# EAGLE design pokey (EAGLE 6.6.0)

## Sheet 1 of 6: Paddles
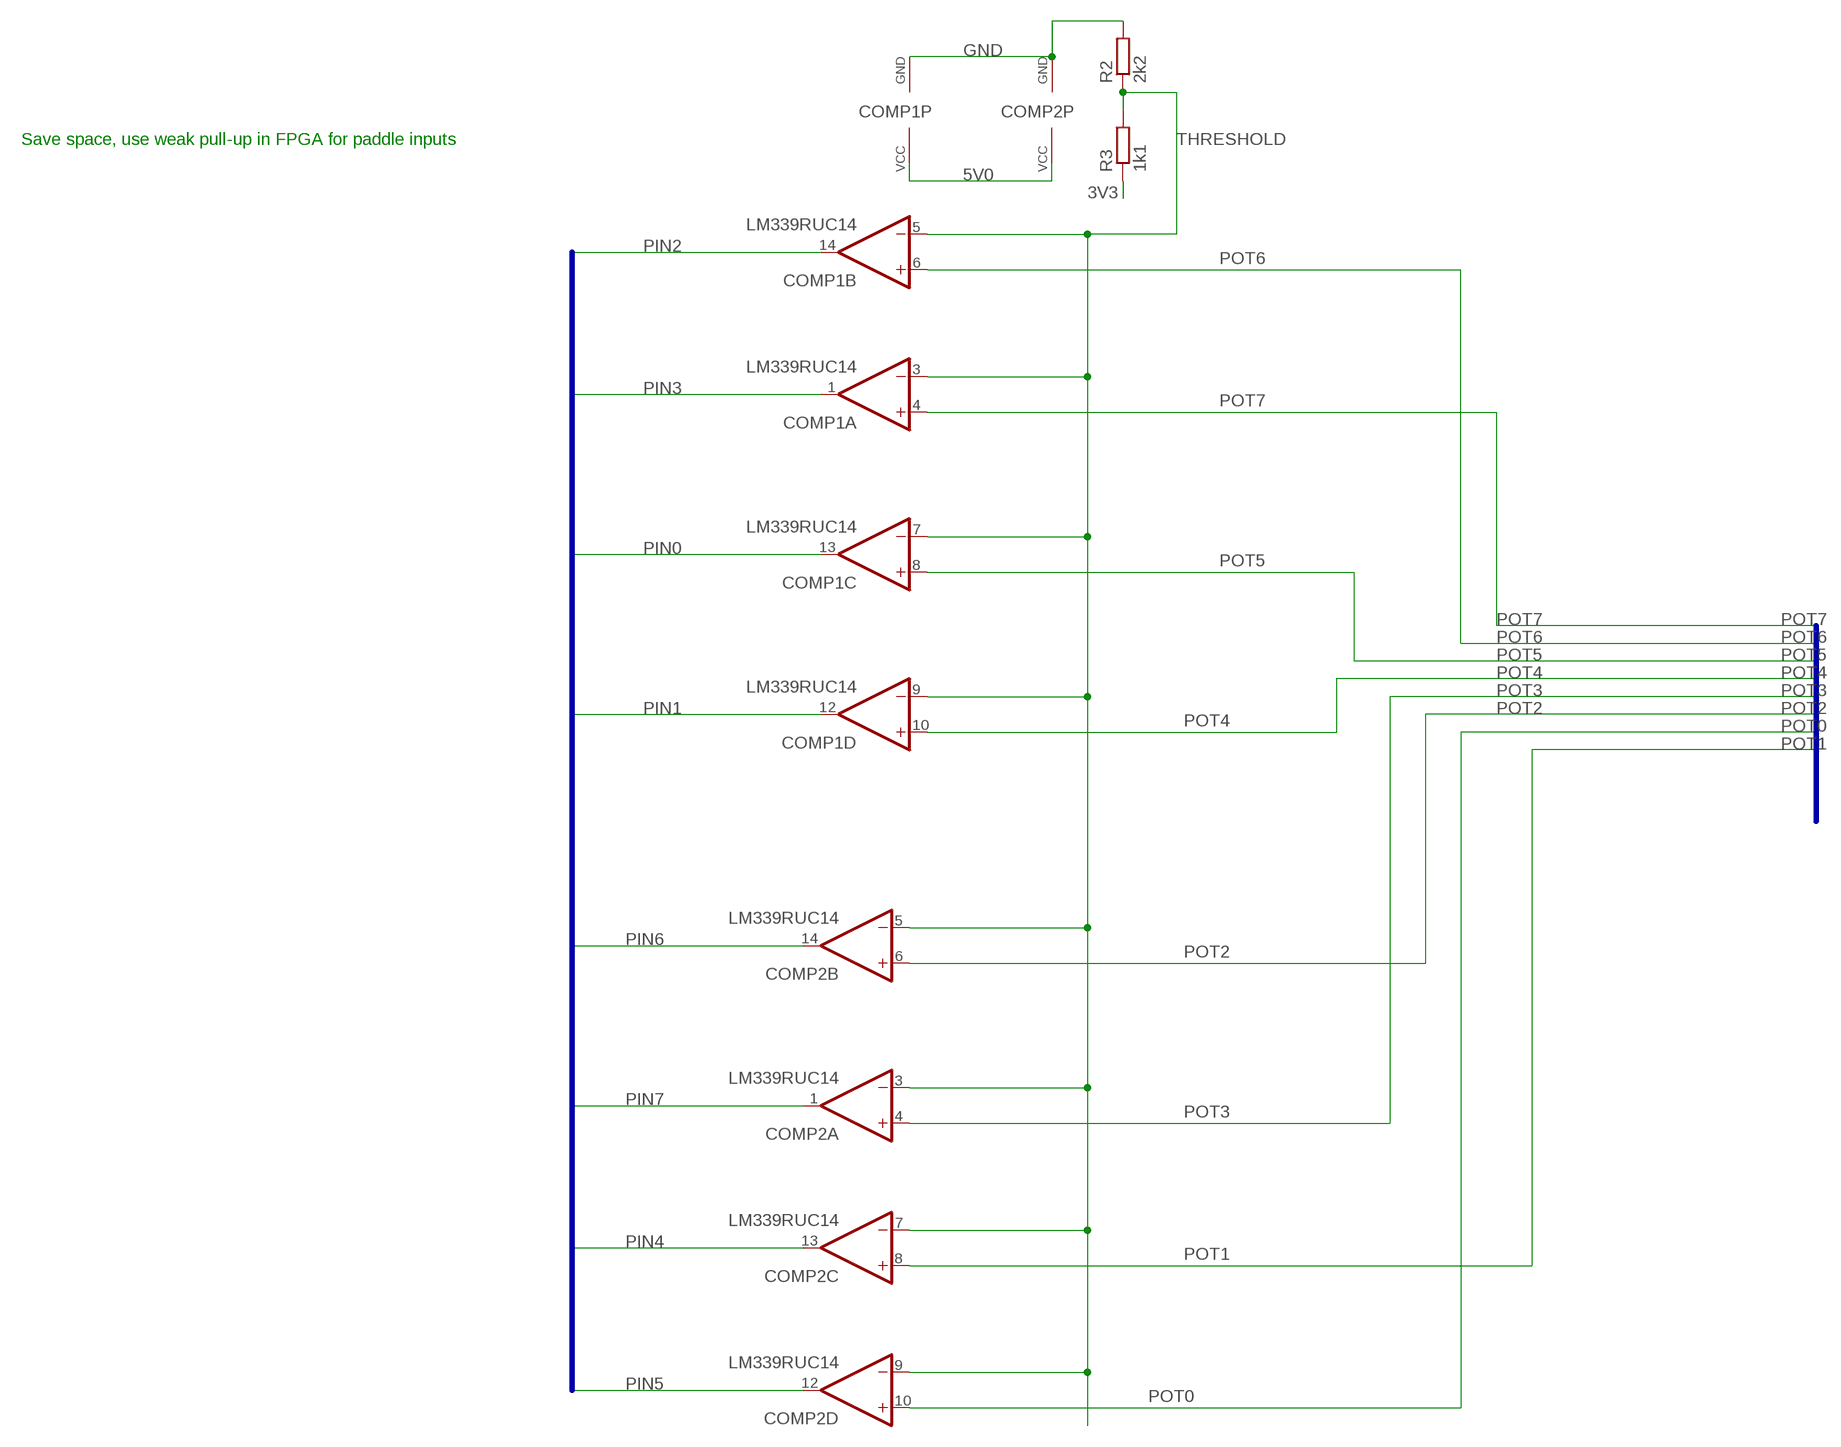
[diagram p0: schematic, sheet 1]

### Parts
COMP1  LM339RUC14  [RUC14]
COMP2  LM339RUC14  [RUC14]
R2  2k2  R-EU_R0402  [R0402]
R3  1k1  R-EU_R0402  [R0402]

### Nets
3V3: R3.1 ; also sheet 2,3,4,6
5V0: COMP1.2(P:VCC) COMP2.2(P:VCC) ; also sheet 3,4,5,6
GND: COMP1.11(P:GND) COMP2.11(P:GND) R2.2 ; also sheet 2,3,4,5,6
PIN0: COMP1.13(C:OUT) ; also sheet 2
PIN1: COMP1.12(D:OUT) ; also sheet 2
PIN2: COMP1.14(B:OUT) ; also sheet 2
PIN3: COMP1.1(A:OUT) ; also sheet 2
PIN4: COMP2.13(C:OUT) ; also sheet 2
PIN5: COMP2.12(D:OUT) ; also sheet 2
PIN6: COMP2.14(B:OUT) ; also sheet 2
PIN7: COMP2.1(A:OUT) ; also sheet 2
POT0: COMP2.10(D:+IN) ; also sheet 3
POT1: COMP2.8(C:+IN) ; also sheet 3
POT2: COMP2.6(B:+IN) ; also sheet 3
POT3: COMP2.4(A:+IN) ; also sheet 3
POT4: COMP1.10(D:+IN) ; also sheet 3
POT5: COMP1.8(C:+IN) ; also sheet 3
POT6: COMP1.6(B:+IN) ; also sheet 3
POT7: COMP1.4(A:+IN) ; also sheet 3
THRESHOLD: COMP1.3(A:-IN) COMP1.5(B:-IN) COMP1.7(C:-IN) COMP1.9(D:-IN) COMP2.3(A:-IN) COMP2.5(B:-IN) COMP2.7(C:-IN) COMP2.9(D:-IN) R2.1 R3.2

### Buses
POT[0..7]
PIN[0..7]

### Notes on the sheet
- Save space, use weak pull-up in FPGA for paddle inputs

## Sheet 2 of 6: FPGA
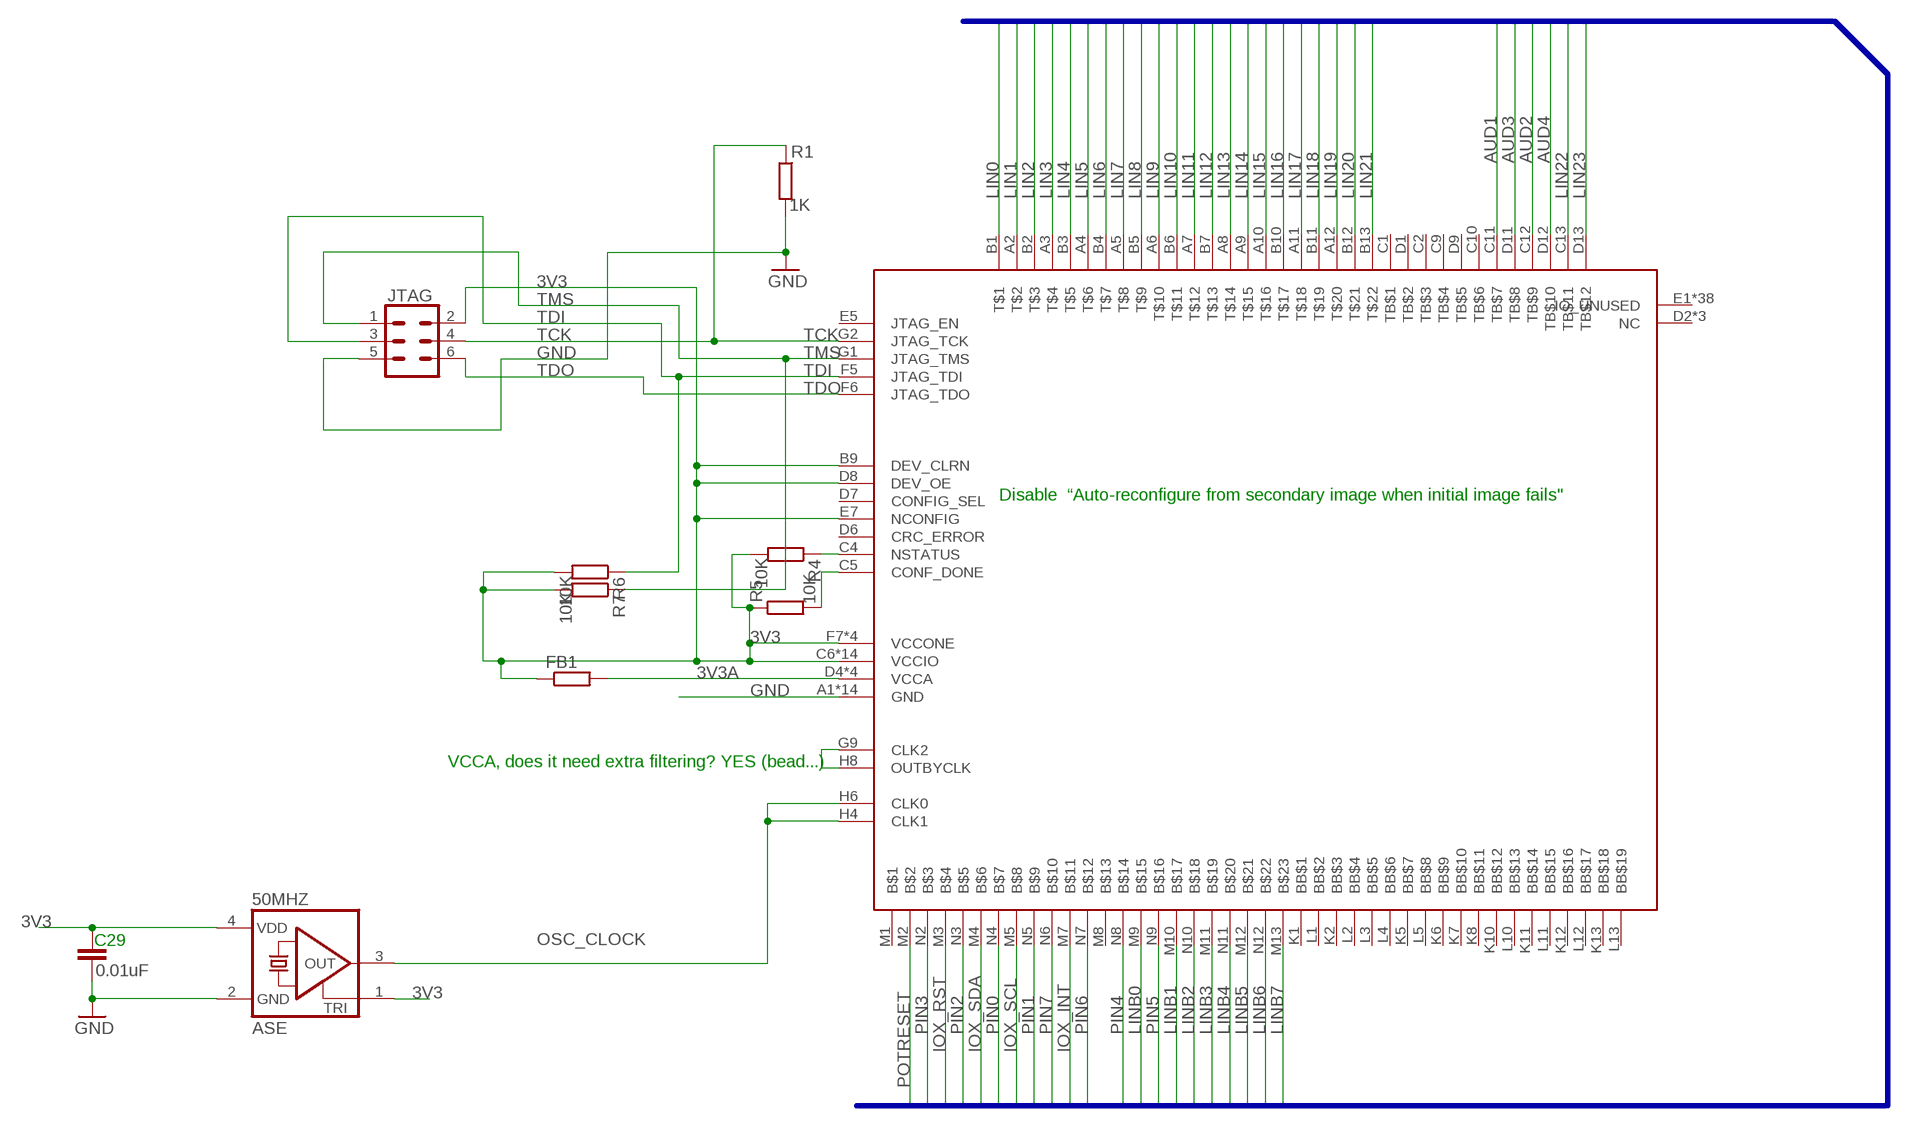
[diagram p1: schematic, sheet 2]

### Parts
50MHZ  ASE  [ASE]
C29  0.01uF  C-EUC0402  [C0402]
FB1  R-EU_R0402  [R0402]
JTAG  CONN_03X2LOCK  [2X3_LOCK]
MAX10  MAX10  [U169SMALL]
R1  1K  R-EU_R0402  [R0402]
R4  10K  R-EU_R0402  [R0402]
R5  10K  R-EU_R0402  [R0402]
R6  10K  R-EU_R0402  [R0402]
R7  10K  R-EU_R0402  [R0402]

### Nets
3V3: 50MHZ.1(TRI) 50MHZ.4(VDD) C29.1 FB1.1 JTAG.2 MAX10.B9(DEV_CLRN) MAX10.C6(VCCIO) MAX10.C7(VCCIO) MAX10.C8(VCCIO) MAX10.D8(DEV_OE) MAX10.E7(NCONFIG) MAX10.F2(VCCIO) MAX10.F7(VCCONE) MAX10.F11(VCCIO) MAX10.G3(VCCIO) MAX10.G6(VCCONE) MAX10.G8(VCCONE) MAX10.G11(VCCIO) MAX10.H7(VCCONE) MAX10.H11(VCCIO) MAX10.J3(VCCIO) MAX10.J11(VCCIO) MAX10.K3(VCCIO) MAX10.L6(VCCIO) MAX10.L7(VCCIO) MAX10.L8(VCCIO) R4.2 R5.1 R6.2 R7.2 ; also sheet 1,3,4,6
3V3A: FB1.2 MAX10.D4(VCCA) MAX10.D10(VCCA) MAX10.K4(VCCA) MAX10.K9(VCCA) ; also sheet 6
AUD1: MAX10.C11(TB$7) ; also sheet 5
AUD2: MAX10.C12(TB$9) ; also sheet 5
AUD3: MAX10.D11(TB$8) ; also sheet 5
AUD4: MAX10.D12(TB$10) ; also sheet 5
CONF_DONE: MAX10.C5(CONF_DONE) R5.2
FAKE_CLK: MAX10.G9(CLK2) MAX10.H8(OUTBYCLK)
GND: 50MHZ.2(GND) C29.2 JTAG.5 MAX10.A1(GND) MAX10.A13(GND) MAX10.B8(GND) MAX10.C3(GND) MAX10.D5(GND) MAX10.E11(GND) MAX10.F3(GND) MAX10.G7(GND) MAX10.H12(GND) MAX10.J4(GND) MAX10.L9(GND) MAX10.M6(GND) MAX10.N1(GND) MAX10.N13(GND) R1.2 ; also sheet 1,3,4,5,6
IOX_INT: MAX10.M7(B$11) ; also sheet 3
IOX_RST: MAX10.M3(B$4) ; also sheet 3
IOX_SCL: MAX10.M5(B$8) ; also sheet 3
IOX_SDA: MAX10.M4(B$6) ; also sheet 3
LIN0: MAX10.B1(T$1) ; also sheet 3
LIN1: MAX10.A2(T$2) ; also sheet 3
LIN2: MAX10.B2(T$3) ; also sheet 3
LIN3: MAX10.A3(T$4) ; also sheet 3
LIN4: MAX10.B3(T$5) ; also sheet 3
LIN5: MAX10.A4(T$6) ; also sheet 3
LIN6: MAX10.B4(T$7) ; also sheet 3
LIN7: MAX10.A5(T$8) ; also sheet 3
LIN8: MAX10.B5(T$9) ; also sheet 3
LIN9: MAX10.A6(T$10) ; also sheet 3
LIN10: MAX10.B6(T$11) ; also sheet 3
LIN11: MAX10.A7(T$12) ; also sheet 3
LIN12: MAX10.B7(T$13) ; also sheet 3
LIN13: MAX10.A8(T$14) ; also sheet 3
LIN14: MAX10.A9(T$15) ; also sheet 3
LIN15: MAX10.A10(T$16) ; also sheet 3
LIN16: MAX10.B10(T$17) ; also sheet 3
LIN17: MAX10.A11(T$18) ; also sheet 3
LIN18: MAX10.B11(T$19) ; also sheet 3
LIN19: MAX10.A12(T$20) ; also sheet 3
LIN20: MAX10.B12(T$21) ; also sheet 3
LIN21: MAX10.B13(T$22) ; also sheet 3
LIN22: MAX10.C13(TB$11) ; also sheet 3
LIN23: MAX10.D13(TB$12) ; also sheet 3
LINB0: MAX10.M9(B$15) ; also sheet 3
LINB1: MAX10.M10(B$17) ; also sheet 3
LINB2: MAX10.N10(B$18) ; also sheet 3
LINB3: MAX10.M11(B$19) ; also sheet 3
LINB4: MAX10.N11(B$20) ; also sheet 3
LINB5: MAX10.M12(B$21) ; also sheet 3
LINB6: MAX10.N12(B$22) ; also sheet 3
LINB7: MAX10.M13(B$23) ; also sheet 3
NSTATUS: MAX10.C4(NSTATUS) R4.1
OSC_CLOCK: 50MHZ.3(OUT) MAX10.H4(CLK1) MAX10.H6(CLK0)
PIN0: MAX10.N4(B$7) ; also sheet 1
PIN1: MAX10.N5(B$9) ; also sheet 1
PIN2: MAX10.N3(B$5) ; also sheet 1
PIN3: MAX10.N2(B$3) ; also sheet 1
PIN4: MAX10.N8(B$14) ; also sheet 1
PIN5: MAX10.N9(B$16) ; also sheet 1
PIN6: MAX10.N7(B$12) ; also sheet 1
PIN7: MAX10.N6(B$10) ; also sheet 1
POTRESET: MAX10.M2(B$2) ; also sheet 3
TCK: JTAG.4 MAX10.G2(JTAG_TCK) R1.1
TDI: JTAG.3 MAX10.F5(JTAG_TDI) R6.1
TDO: JTAG.6 MAX10.F6(JTAG_TDO)
TMS: JTAG.1 MAX10.G1(JTAG_TMS) R7.1
Unconnected: MAX10.C1(TB$1) MAX10.C2(TB$3) MAX10.C9(TB$4) MAX10.C10(TB$6) MAX10.D1(TB$2) MAX10.D2(NC) MAX10.D3(NC) MAX10.D6(CRC_ERROR) MAX10.D7(CONFIG_SEL) MAX10.D9(TB$5) MAX10.E1(IO_UNUSED) MAX10.E2(NC) MAX10.E3(IO_UNUSED) MAX10.E4(IO_UNUSED) MAX10.E5(JTAG_EN) MAX10.E6(IO_UNUSED) MAX10.E8(IO_UNUSED) MAX10.E9(IO_UNUSED) MAX10.E10(IO_UNUSED) MAX10.E12(IO_UNUSED) MAX10.E13(IO_UNUSED) MAX10.F1(IO_UNUSED) MAX10.F4(IO_UNUSED) MAX10.F8(IO_UNUSED) MAX10.F9(IO_UNUSED) MAX10.F10(IO_UNUSED) MAX10.F12(IO_UNUSED) MAX10.F13(IO_UNUSED) MAX10.G4(IO_UNUSED) MAX10.G5(IO_UNUSED) MAX10.G10(IO_UNUSED) MAX10.G12(IO_UNUSED) MAX10.G13(IO_UNUSED) MAX10.H1(IO_UNUSED) MAX10.H2(IO_UNUSED) MAX10.H3(IO_UNUSED) MAX10.H5(IO_UNUSED) MAX10.H9(IO_UNUSED) MAX10.H10(IO_UNUSED) MAX10.H13(IO_UNUSED) MAX10.J1(IO_UNUSED) MAX10.J2(IO_UNUSED) MAX10.J5(IO_UNUSED) MAX10.J6(IO_UNUSED) MAX10.J7(IO_UNUSED) MAX10.J8(IO_UNUSED) MAX10.J9(IO_UNUSED) MAX10.J10(IO_UNUSED) MAX10.J12(IO_UNUSED) MAX10.J13(IO_UNUSED) MAX10.K1(BB$1) MAX10.K2(BB$3) MAX10.K5(BB$7) MAX10.K6(BB$9) MAX10.K7(BB$10) MAX10.K8(BB$11) MAX10.K10(BB$12) MAX10.K11(BB$14) MAX10.K12(BB$16) MAX10.K13(BB$18) MAX10.L1(BB$2) MAX10.L2(BB$4) MAX10.L3(BB$5) MAX10.L4(BB$6) MAX10.L5(BB$8) MAX10.L10(BB$13) MAX10.L11(BB$15) MAX10.L12(BB$17) MAX10.L13(BB$19) MAX10.M1(B$1) MAX10.M8(B$13)

### Buses
LIN[0..23],LINB[0..7],PIN[0..7],IOX_SCL,IOX_SDA,IOX_INT,IOX_RST,AUD[1..4],POTRESET

### Notes on the sheet
- Disable  “Auto-reconfigure from secondary image when initial image fails"
- VCCA, does it need extra filtering? YES (bead...)

## Sheet 3 of 6: Level conv
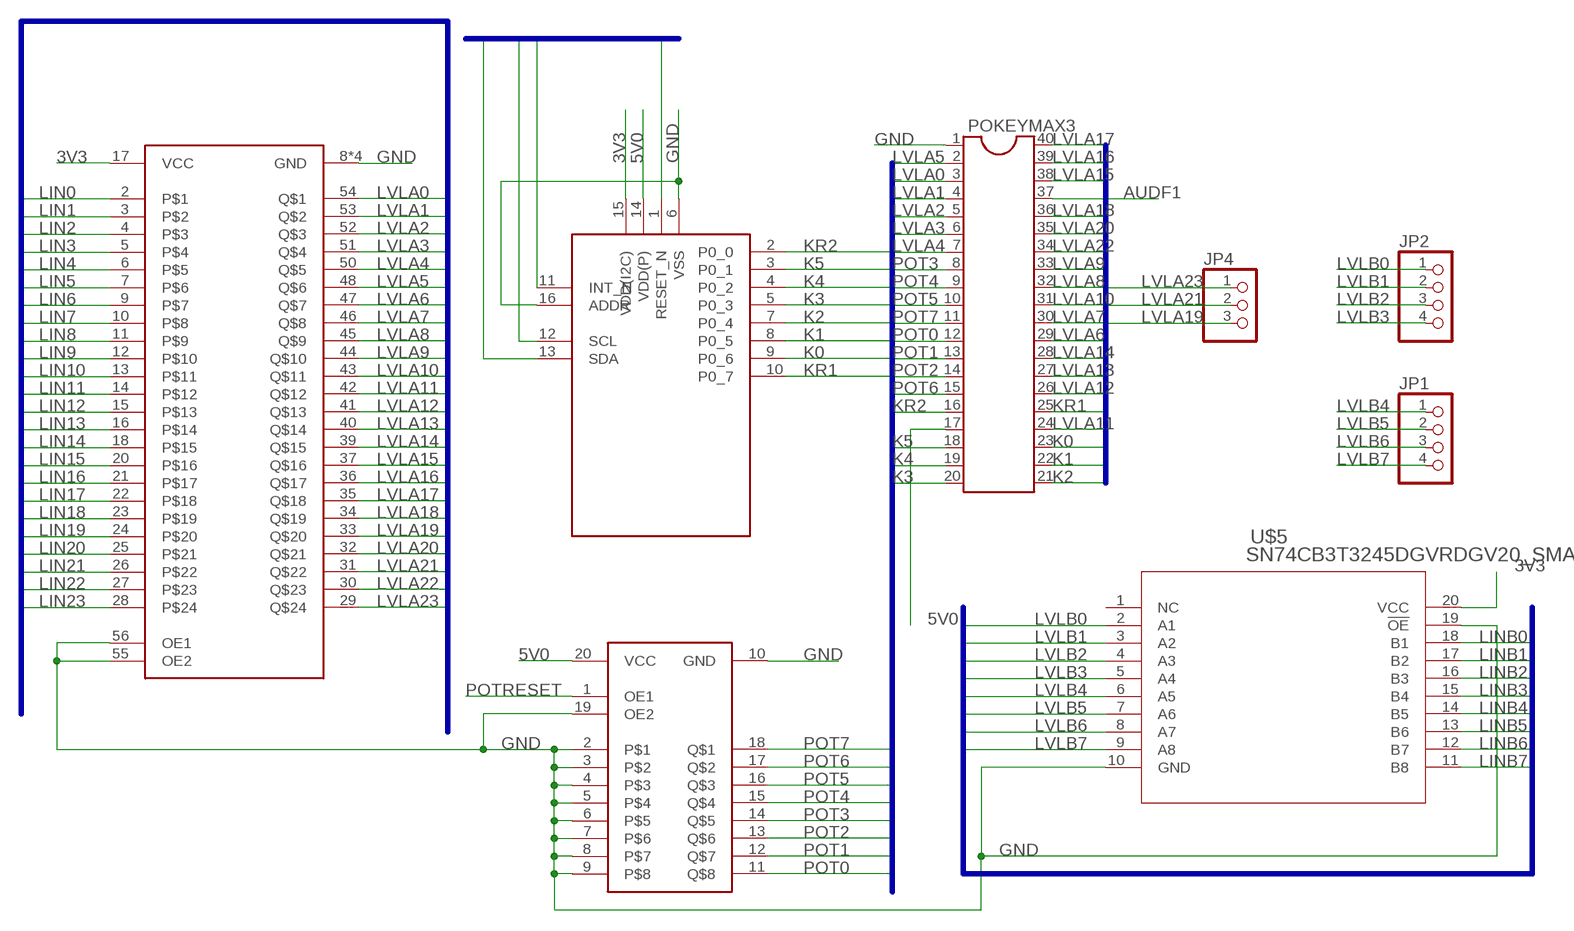
[diagram p2: schematic, sheet 3]

### Parts
JP1  PINHD-1X4  [1X04]
JP2  PINHD-1X4  [1X04]
JP4  PINHD-1X3  [1X03]
POKEYMAX3  DIL40  [DIL40]
U$1  PCAL6408A  [XQFN16V2]
U$2  SN74CB3T16211SM  [56TVSOP_SMALL]
U$4  74AHCT541ADHVQFN-EP  [DHVQFN-EP]
U$5  SN74CB3T3245DGVRDGV20_SMALL  [DGV20_SMALL]

### Nets
3V3: U$1.15(VDD(I2C)) U$2.17(VCC) U$5.20(VCC) ; also sheet 1,2,4,6
5V0: POKEYMAX3.17 U$1.14(VDD(P)) U$4.20(VCC) ; also sheet 1,4,5,6
AUDF1: POKEYMAX3.37 ; also sheet 5
GND: POKEYMAX3.1 U$1.6(VSS) U$1.16(ADDR) U$2.8(GND) U$2.19(GND) U$2.38(GND) U$2.49(GND) U$2.55(OE2) U$2.56(OE1) U$4.2 U$4.3 U$4.4 U$4.5 U$4.6 U$4.7 U$4.8 U$4.9 U$4.10(GND) U$4.19(OE2) U$5.10(GND) U$5.19(!OE) ; also sheet 1,2,4,5,6
IOX_INT: U$1.11(INT_N) ; also sheet 2
IOX_RST: U$1.1(RESET_N) ; also sheet 2
IOX_SCL: U$1.12(SCL) ; also sheet 2
IOX_SDA: U$1.13(SDA) ; also sheet 2
K0: POKEYMAX3.23 U$1.9(P0_6)
K1: POKEYMAX3.22 U$1.8(P0_5)
K2: POKEYMAX3.21 U$1.7(P0_4)
K3: POKEYMAX3.20 U$1.5(P0_3)
K4: POKEYMAX3.19 U$1.4(P0_2)
K5: POKEYMAX3.18 U$1.3(P0_1)
KR1: POKEYMAX3.25 U$1.10(P0_7)
KR2: POKEYMAX3.16 U$1.2(P0_0)
LIN0: U$2.2 ; also sheet 2
LIN1: U$2.3 ; also sheet 2
LIN2: U$2.4 ; also sheet 2
LIN3: U$2.5 ; also sheet 2
LIN4: U$2.6 ; also sheet 2
LIN5: U$2.7 ; also sheet 2
LIN6: U$2.9 ; also sheet 2
LIN7: U$2.10 ; also sheet 2
LIN8: U$2.11 ; also sheet 2
LIN9: U$2.12 ; also sheet 2
LIN10: U$2.13 ; also sheet 2
LIN11: U$2.14 ; also sheet 2
LIN12: U$2.15 ; also sheet 2
LIN13: U$2.16 ; also sheet 2
LIN14: U$2.18 ; also sheet 2
LIN15: U$2.20 ; also sheet 2
LIN16: U$2.21 ; also sheet 2
LIN17: U$2.22 ; also sheet 2
LIN18: U$2.23 ; also sheet 2
LIN19: U$2.24 ; also sheet 2
LIN20: U$2.25 ; also sheet 2
LIN21: U$2.26 ; also sheet 2
LIN22: U$2.27 ; also sheet 2
LIN23: U$2.28 ; also sheet 2
LINB0: U$5.18(B1) ; also sheet 2
LINB1: U$5.17(B2) ; also sheet 2
LINB2: U$5.16(B3) ; also sheet 2
LINB3: U$5.15(B4) ; also sheet 2
LINB4: U$5.14(B5) ; also sheet 2
LINB5: U$5.13(B6) ; also sheet 2
LINB6: U$5.12(B7) ; also sheet 2
LINB7: U$5.11(B8) ; also sheet 2
LVLA0: POKEYMAX3.3 U$2.54(Q$1)
LVLA1: POKEYMAX3.4 U$2.53(Q$2)
LVLA2: POKEYMAX3.5 U$2.52(Q$3)
LVLA3: POKEYMAX3.6 U$2.51(Q$4)
LVLA4: POKEYMAX3.7 U$2.50(Q$5)
LVLA5: POKEYMAX3.2 U$2.48(Q$6)
LVLA6: POKEYMAX3.29 U$2.47(Q$7)
LVLA7: POKEYMAX3.30 U$2.46(Q$8)
LVLA8: POKEYMAX3.32 U$2.45(Q$9)
LVLA9: POKEYMAX3.33 U$2.44(Q$10)
LVLA10: POKEYMAX3.31 U$2.43(Q$11)
LVLA11: POKEYMAX3.24 U$2.42(Q$12)
LVLA12: POKEYMAX3.26 U$2.41(Q$13)
LVLA13: POKEYMAX3.27 U$2.40(Q$14)
LVLA14: POKEYMAX3.28 U$2.39(Q$15)
LVLA15: POKEYMAX3.38 U$2.37(Q$16)
LVLA16: POKEYMAX3.39 U$2.36(Q$17)
LVLA17: POKEYMAX3.40 U$2.35(Q$18)
LVLA18: POKEYMAX3.36 U$2.34(Q$19)
LVLA19: JP4.3 U$2.33(Q$20)
LVLA20: POKEYMAX3.35 U$2.32(Q$21)
LVLA21: JP4.2 U$2.31(Q$22)
LVLA22: POKEYMAX3.34 U$2.30(Q$23)
LVLA23: JP4.1 U$2.29(Q$24)
LVLB0: JP2.1 U$5.2(A1)
LVLB1: JP2.2 U$5.3(A2)
LVLB2: JP2.3 U$5.4(A3)
LVLB3: JP2.4 U$5.5(A4)
LVLB4: JP1.1 U$5.6(A5)
LVLB5: JP1.2 U$5.7(A6)
LVLB6: JP1.3 U$5.8(A7)
LVLB7: JP1.4 U$5.9(A8)
POT0: POKEYMAX3.12 U$4.11(Q$8) ; also sheet 1
POT1: POKEYMAX3.13 U$4.12(Q$7) ; also sheet 1
POT2: POKEYMAX3.14 U$4.13(Q$6) ; also sheet 1
POT3: POKEYMAX3.8 U$4.14(Q$5) ; also sheet 1
POT4: POKEYMAX3.9 U$4.15(Q$4) ; also sheet 1
POT5: POKEYMAX3.10 U$4.16(Q$3) ; also sheet 1
POT6: POKEYMAX3.15 U$4.17(Q$2) ; also sheet 1
POT7: POKEYMAX3.11 U$4.18(Q$1) ; also sheet 1
POTRESET: U$4.1(OE1) ; also sheet 2
Unconnected: U$5.1(NC)

### Buses
LVLA[0..23],LVLB[0..7],KR[1..2],K[0..5]
LIN[0..23],LVLA[0..23]
LVLA[0..23],POT[0..7],POTCH[0..7],KR[1..2],K[0..5]
IOX_SCL,IOX_SDA,IOX_INT,IOX_RST
LVLB[0..7],LINB[0..7]

## Sheet 4 of 6: Power regs
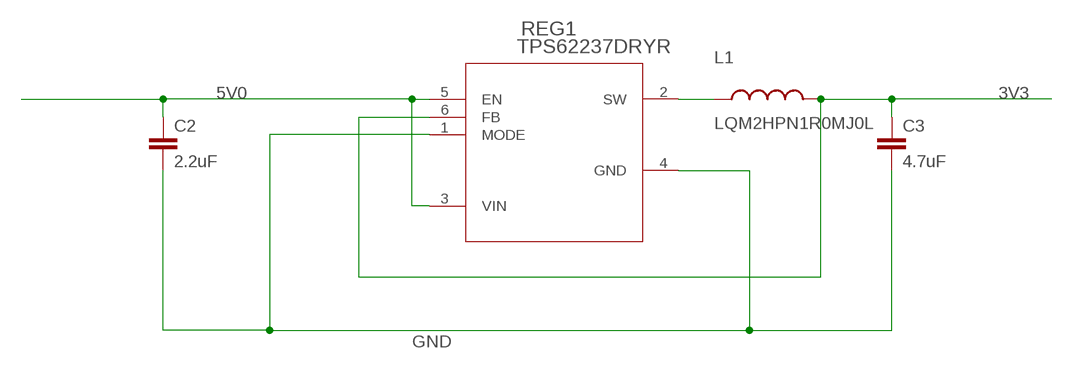
[diagram p3: schematic, sheet 4]

### Parts
C2  2.2uF  C-EUC0402  [C0402]
C3  4.7uF  C-EUC0402  [C0402]
L1  LQM2HPN1R0MJ0L  [INDC1008X04]
REG1  TPS62237DRYR  [DRY6]

### Nets
3V3: C3.1 L1.2 REG1.6(FB) ; also sheet 1,2,3,6
5V0: C2.1 REG1.3(VIN) REG1.5(EN) ; also sheet 1,3,5,6
GND: C2.2 C3.2 REG1.1(MODE) REG1.4(GND) ; also sheet 1,2,3,5,6
N$137: L1.1 REG1.2(SW)

## Sheet 5 of 6: Audio filter
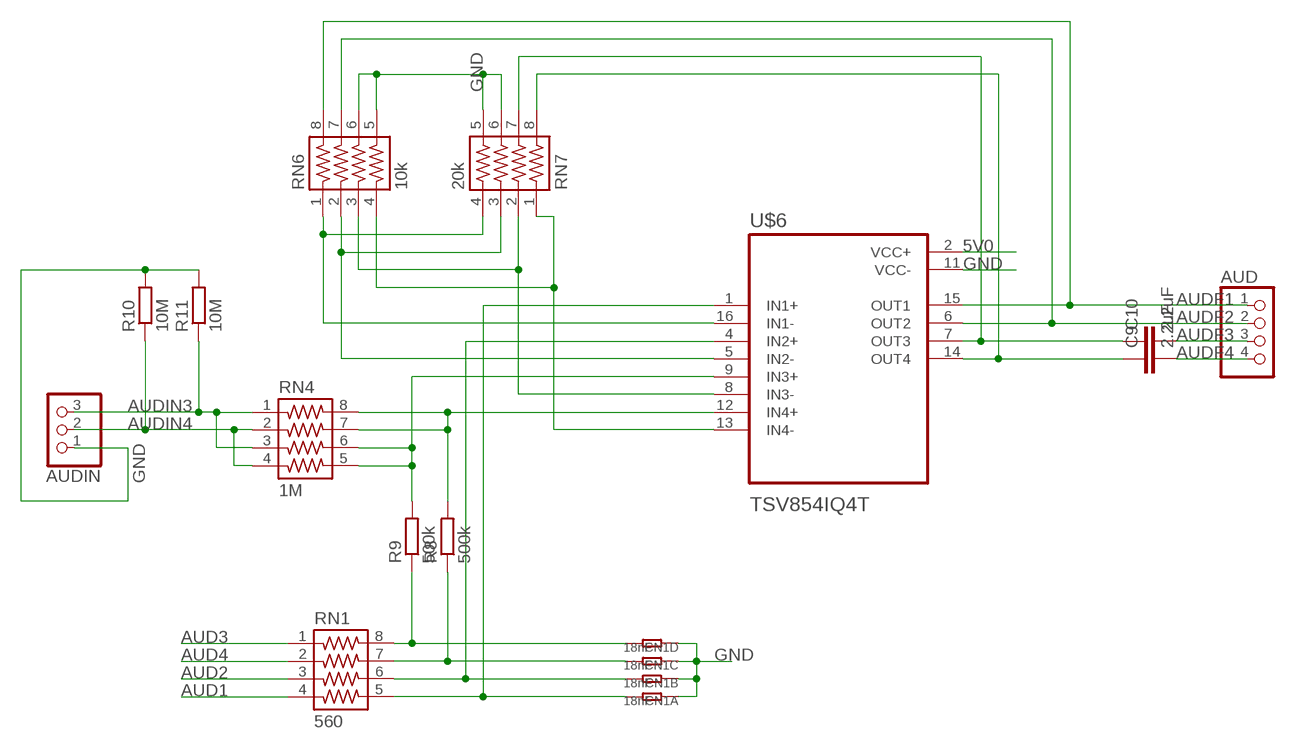
[diagram p4: schematic, sheet 5]

### Parts
AUD  PINHD-1X4  [1X04]
AUDIN  PINHD-1X3  [1X03]
C9  2.2uF  C-EUC0402  [C0402]
C10  2.2uF  C-EUC0402  [C0402]
CN1  18nF  R-4R  [R1206-8]
R8  500k  R-EU_R0402  [R0402]
R9  500k  R-EU_R0402  [R0402]
R10  10M  R-EU_R0402  [R0402]
R11  10M  R-EU_R0402  [R0402]
RN1  560  742-8  [742-8]
RN4  1M  742-8  [742-8]
RN6  10k  742-8  [742-8]
RN7  20k  742-8  [742-8]
U$6  TSV854IQ4T  [QFN50P300X300X100-16N]

### Nets
5V0: U$6.2(VCC+) ; also sheet 1,3,4,6
AMPIN1M: RN6.1 RN7.4 U$6.16(IN1-)
AMPIN1P: CN1.8 RN1.5 U$6.1(IN1+)
AMPIN2M: RN6.2 RN7.3 U$6.5(IN2-)
AMPIN2P: CN1.7 RN1.6 U$6.4(IN2+)
AMPIN3M: RN6.3 RN7.2 U$6.8(IN3-)
AMPIN3P: R9.2 RN4.5 RN4.6 U$6.9(IN3+)
AMPIN4P: R8.2 RN4.7 RN4.8 U$6.12(IN4+)
AUD1: RN1.4 ; also sheet 2
AUD2: RN1.3 ; also sheet 2
AUD3: RN1.1 ; also sheet 2
AUD4: RN1.2 ; also sheet 2
AUDF1: AUD.1 RN6.8 U$6.15(OUT1) ; also sheet 3
AUDF2: AUD.2 RN6.7 U$6.6(OUT2)
AUDF3: AUD.3 C10.2
AUDF4: AUD.4 C9.2
AUDIN3: AUDIN.3 R11.1 RN4.1 RN4.3
AUDIN4: AUDIN.2 R10.1 RN4.2 RN4.4
GND: AUDIN.1 CN1.1 CN1.2 CN1.3 CN1.4 R10.2 R11.2 RN6.5 RN6.6 RN7.5 RN7.6 U$6.11(VCC-) ; also sheet 1,2,3,4,6
N$1: CN1.5 R9.1 RN1.8
N$2: CN1.6 R8.1 RN1.7
N$5: C9.1 RN7.8 U$6.14(OUT4)
N$6: C10.1 RN7.7 U$6.7(OUT3)
N$22: RN6.4 RN7.1 U$6.13(IN4-)

## Sheet 6 of 6: Decoupling
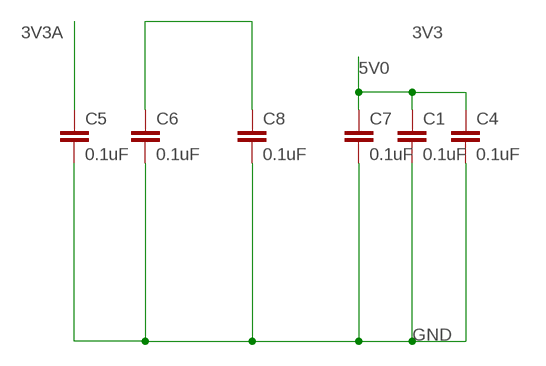
[diagram p5: schematic, sheet 6]

### Parts
C1  0.1uF  C-EUC0402  [C0402]
C4  0.1uF  C-EUC0402  [C0402]
C5  0.1uF  C-EUC0402  [C0402]
C6  0.1uF  C-EUC0402  [C0402]
C7  0.1uF  C-EUC0402  [C0402]
C8  0.1uF  C-EUC0402  [C0402]

### Nets
3V3: C6.1 C8.1 ; also sheet 1,2,3,4
3V3A: C5.1 ; also sheet 2
5V0: C1.1 C4.1 C7.1 ; also sheet 1,3,4,5
GND: C1.2 C4.2 C5.2 C6.2 C7.2 C8.2 ; also sheet 1,2,3,4,5

## Library data of the parts
50MHZ = crystal:ASE: 3.3Vdc CMOS SMD CRYSTAL CLOCK OSCILLATOR SOurce: www.abracon.com; OC_FARNELL: unknown; OC_NEWARK: unknown
AUD JP1 JP2 = max10:PINHD-1X4: PIN HEADER
AUDIN JP4 = max10:PINHD-1X3: PIN HEADER
C1-C10 C29 = rcl:C-EU: CAPACITOR, European symbol
CN1 = Discrete:R-4R*: Resistor Array
COMP1 COMP2 = max10:LM339: Based on information from the SLCS006N datasheet from TI (www.ti.com). Change Log Date Author Change July 16, 2008 nick@scantool.net Device created.
FB1 R1-R11 = rcl:R-EU_: RESISTOR, European symbol
JTAG = SparkFun-Connectors:CONN_03X2: Multi connection point. Often used as Generic Header-pin footprint for 0.1 inch spaced/style header connections You can populate with any combo of single row headers, but if you'd like an exact match, check these: Header - 2x3 (Male, 0.1") <https://www.sparkfun.com/products/12807> (PRT-12807) Header - 2x3 (Female, 0.1") <https://www.sparkfun.com/products/13010> (PRT-13010) 2x3 Pin Shrouded Header <https://www.sparkfun.com/products/10877> (PRT-10877) On any of the 0.1 inch spaced packages, you can populate with these: Break Away Headers - Straight <https://www.sparkfun.com/products/116> (PRT-00116) Break Away Male Headers - Right Angle <https://www.sparkfun.com/products/553> (PRT-00553) Female Headers <https://www.sparkfun.com/products/115> (PRT-00115) Break Away Headers - Machine Pin <https://www.sparkfun.com/products/117> (PRT-00117) Break Away Female Headers - Swiss Machine Pin <https://www.sparkfun.com/products/743> (PRT-00743) Special note: the shrouded connector mates well with our 3x2 ribbon cables: Ribbon Crimp Connector - 6-pin (2x3, Female) <https://www.sparkfun.com/products/10651> (PRT-10651) Ribbon Cable - 6 wire (15ft) <https://www.sparkfun.com/products/10646> (PRT-10646)
L1 = LQM2HPN1R0MJ0L:LQM2HPN1R0MJ0L: Inductor Power Chip Shielded Multi-Layer 1uH 20% 1MHz Ferrite 1.5A 113mOhm DCR 1008 Embossed T/R; DESCRIPTION: Inductor Power Chip Shielded Multi-Layer 1uH 20% 1MHz Ferrite 1.5A 113mOhm DCR 1008 Embossed T/R; DIGI-KEY_PART_NUMBER: 490-6699-1-ND; DIGI-KEY_PURCHASE_URL: https://www.digikey.com/product-detail/en/murata-electronics-north-america/LQM2HPN1R0MJ0L/490-6699-1-ND/3845896?utm_source=snapeda&utm_medium=aggregator&utm_campaign=symbol; MF: Murata Electronics; MP: LQM2HPN1R0MJ0L; PACKAGE: 1008 Murata
MAX10 = max10:MAX10
POKEYMAX3 = ic-package:DIL40: Dual In Line
REG1 = max10:TPS62237DRYR; MANUFACTURER_PART_NUMBER: TPS62237DRYR; VENDOR: Texas Instruments
RN1 RN4 RN6 RN7 = resistor-array:742-8: CTS 742 Series 8 Terminations, 4 Resistors
U$1 = max10:PCAL6408A
U$2 = max10:SN74CB3T16211
U$4 = max10:74AHCT541A
U$5 = max10:SN74CB3T3245DGVR
U$6 = TSV854IQ4T:TSV854IQ4T: None; AVAILABILITY: Unavailable; DESCRIPTION: General Purpose Amplifier 4 Circuit Rail-to-Rail 16-QFN _3x3_; MF: STMicroelectronics; MP: TSV854IQ4T; PACKAGE: QFN-16 STMicroelectronics; PRICE: None

## Board
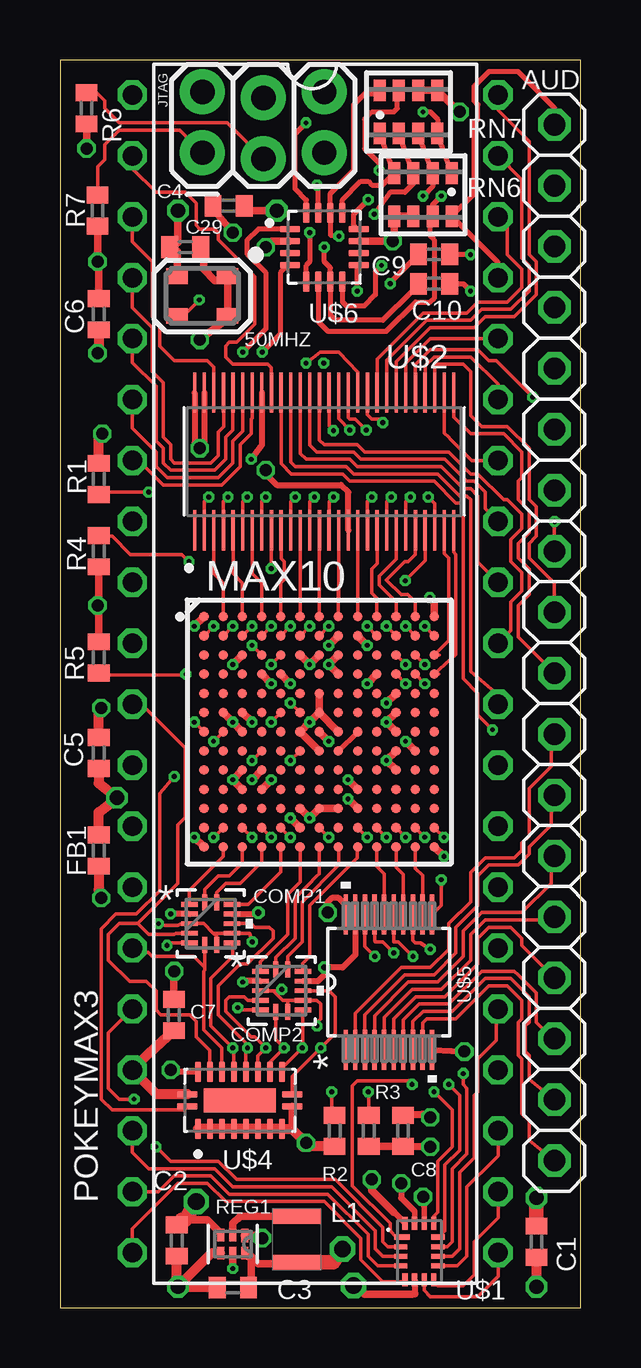
[diagram p6: board, top side]
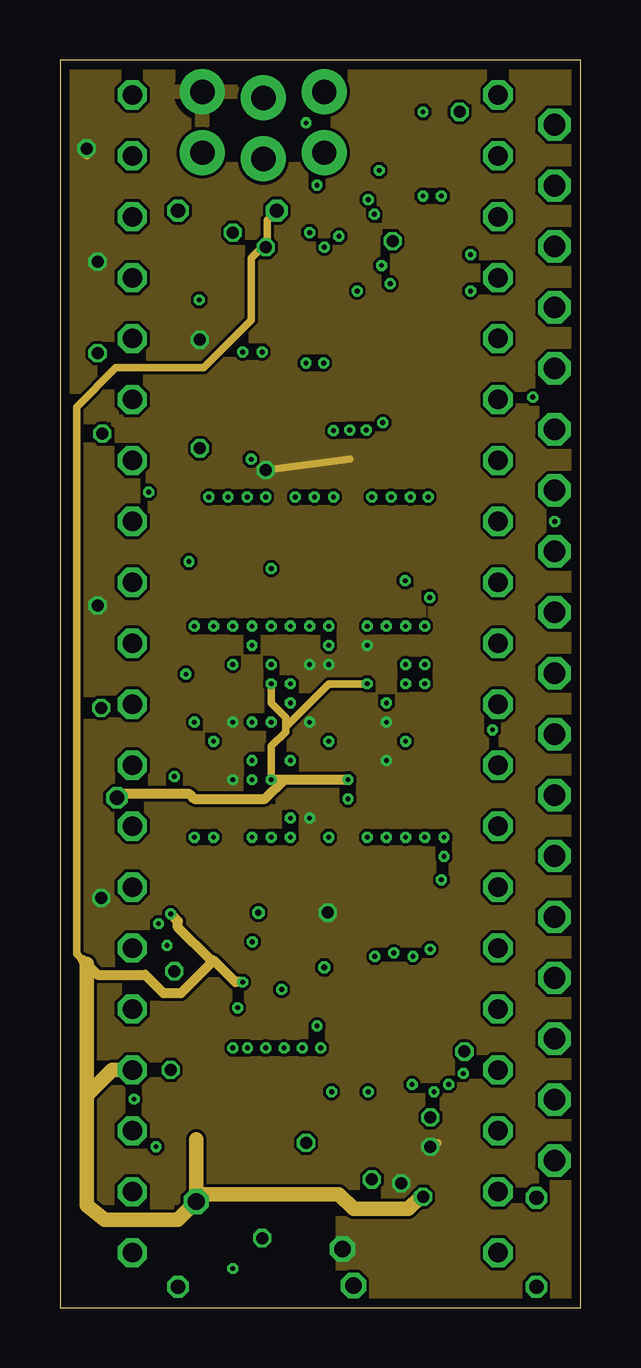
[diagram p7: board, inner layer Route2]
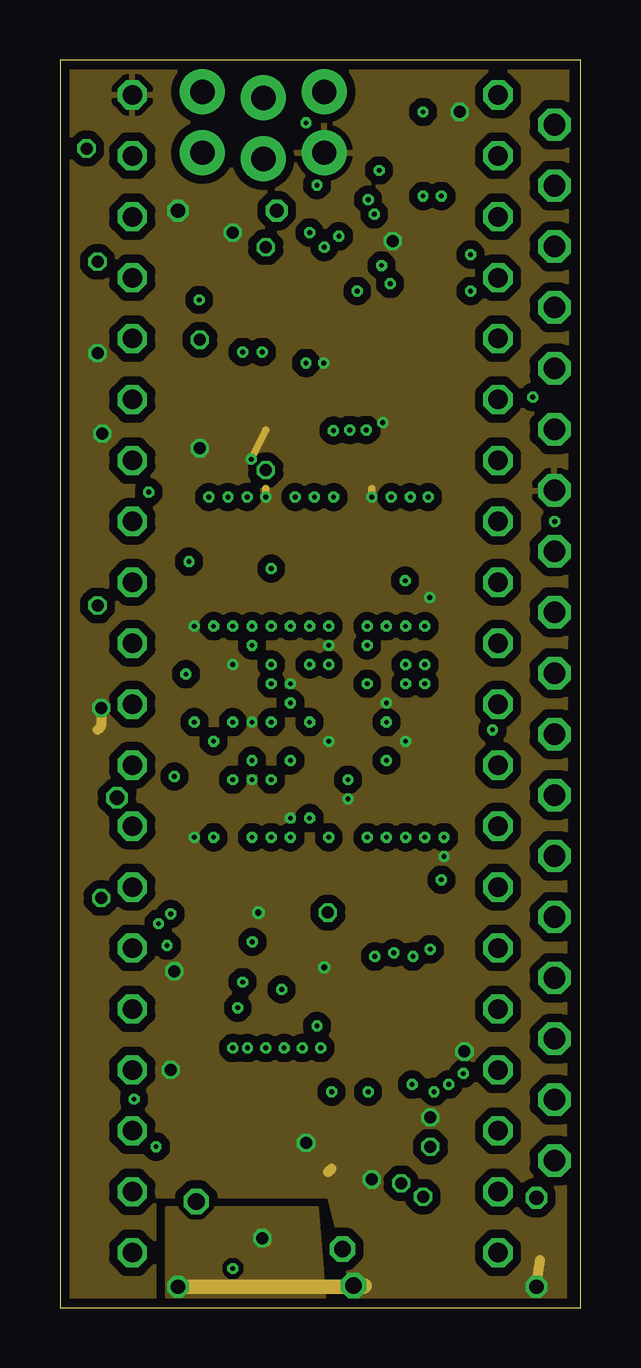
[diagram p8: board, inner layer Route15]
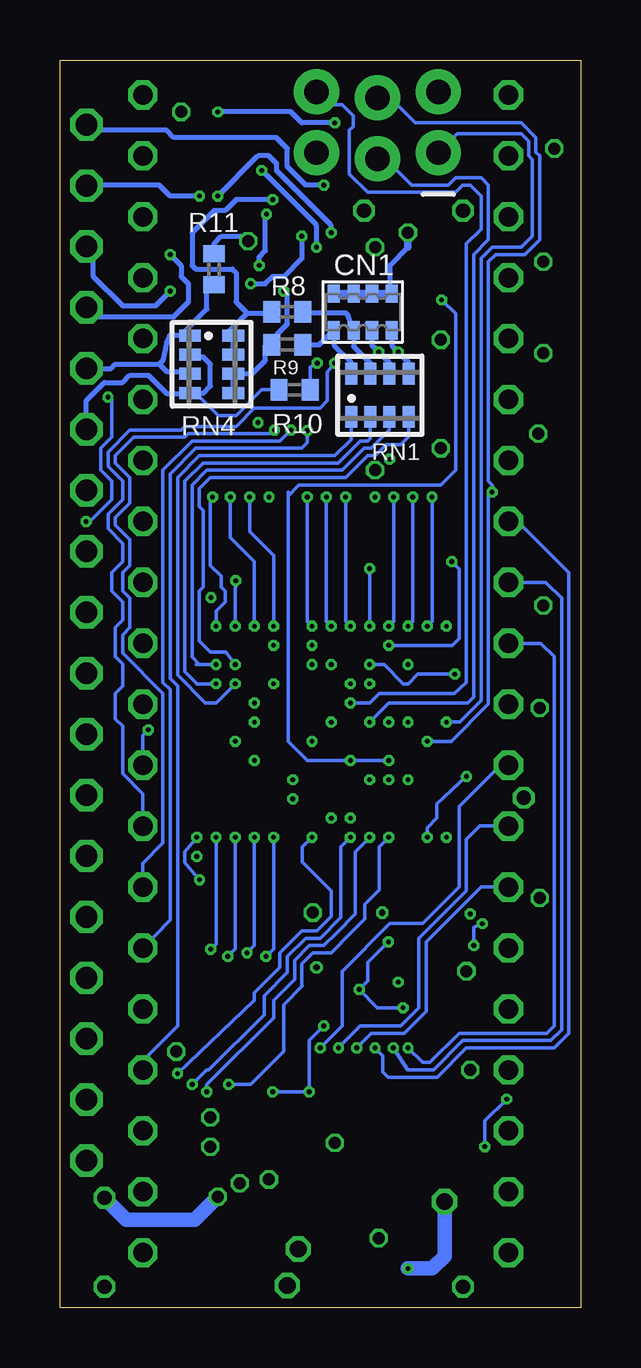
[diagram p9: board, bottom side, seen from below]

Size 21.7 x 52 mm. Coordinates in mm from the lower left corner, seen from the top.
Outline: 21.7,52 0,52 0,0 21.7,0 21.7,52
Copper layers (1*2*15*16): Top 0.035559375mm / dielectric 1.6mm / Route2 0.0356mm / dielectric 0.1499mm / Route15 0.0356mm / dielectric 0.2007mm / Bottom 0.035559375mm
Design rules "oshpark-2layer_5mil *": minimum track width 6mil, minimum drill 0.2mm, track to track 5mil, track to pad 5mil, pad to pad 5mil, via to via 5mil, smd to smd 5mil, copper to edge 15mil, drill to drill 6mil, minimum pad ring 5mil, minimum via ring 5mil, stop-mask expansion 2.5mil, vias tented up to drill 20mil, thermal gap 10mil

### Footprints (pad centres in the part's own frame; a part is rotated, then mirrored left to right if it is on the bottom)
ASE = smd 0.9 x 0.65: 1 -1.05,-0.825; 2 1.05,-0.825; 3 1.05,0.825; 4 -1.05,0.825
1X04 = drill 0.9 octagon: 1 -3.81,0; 2 -1.27,0; 3 1.27,0; 4 3.81,0
1X03 = drill 0.9 octagon: 1 -2.54,0; 2 0,0; 3 2.54,0
C0402 = smd 0.7 x 0.9: 1 -0.65,0; 2 0.65,0
R1206-8 = smd 0.508 x 0.762: 1 -1.206,-0.762; 2 -0.381,-0.762; 3 0.381,-0.762; 4 1.206,-0.762; 5 1.206,0.762; 6 0.381,0.762; 7 -0.381,0.762; 8 -1.206,0.762
RUC14 = smd 0.68 x 0.2: 1 -0.885,0.8; 2 -0.885,0.4; 3 -0.885,0; 4 -0.885,-0.4; 5 -0.885,-0.8; 8 0.885,-0.8; 9 0.885,-0.4; 10 0.885,0; 11 0.885,0.4; 12 0.885,0.8 | smd 0.2 x 0.68: 6 -0.25,-0.885; 7 0.25,-0.885; 13 0.25,0.885; 14 -0.25,0.885
R0402 = smd 0.7 x 0.9: 1 -0.65,0; 2 0.65,0
2X3_LOCK = drill 1.016 pad 1.88: 1 0,0.127; 2 0,2.667; 3 2.54,-0.127; 4 2.54,2.413; 5 5.08,0.127; 6 5.08,2.667
INDC1008X04 = smd 0.6 x 2: 1 -0.95,0; 2 0.95,0
U169SMALL = smd 0.4 x 0.4: A1 -4.8,4.8; A2 -4,4.8; A3 -3.2,4.8; A4 -2.4,4.8; A5 -1.6,4.8; A6 -0.8,4.8; A7 0,4.8; A8 0.8,4.8; A9 1.6,4.8; A10 2.4,4.8; A11 3.2,4.8; A12 4,4.8; A13 4.8,4.8; B1 -4.8,4; B2 -4,4; B3 -3.2,4; B4 -2.4,4; B5 -1.6,4; B6 -0.8,4; B7 0,4; B8 0.8,4; B9 1.6,4; B10 2.4,4; B11 3.2,4; B12 4,4; B13 4.8,4; C1 -4.8,3.2; C2 -4,3.2; C3 -3.2,3.2; C4 -2.4,3.2; C5 -1.6,3.2; C6 -0.8,3.2; C7 0,3.2; C8 0.8,3.2; C9 1.6,3.2; C10 2.4,3.2; C11 3.2,3.2; C12 4,3.2; C13 4.8,3.2; D1 -4.8,2.4; D2 -4,2.4; D3 -3.2,2.4; D4 -2.4,2.4; D5 -1.6,2.4; D6 -0.8,2.4; D7 0,2.4; D8 0.8,2.4; D9 1.6,2.4; D10 2.4,2.4; D11 3.2,2.4; D12 4,2.4; D13 4.8,2.4; E1 -4.8,1.6; E2 -4,1.6; E3 -3.2,1.6; E4 -2.4,1.6; E5 -1.6,1.6; E6 -0.8,1.6; E7 0,1.6; E8 0.8,1.6; E9 1.6,1.6; E10 2.4,1.6; E11 3.2,1.6; E12 4,1.6; E13 4.8,1.6; F1 -4.8,0.8; F2 -4,0.8; F3 -3.2,0.8; F4 -2.4,0.8; F5 -1.6,0.8; F6 -0.8,0.8; F7 0,0.8; F8 0.8,0.8; F9 1.6,0.8; F10 2.4,0.8; F11 3.2,0.8; F12 4,0.8; F13 4.8,0.8; G1 -4.8,0; G2 -4,0; G3 -3.2,0; G4 -2.4,0; G5 -1.6,0; G6 -0.8,0; G7 0,0; G8 0.8,0; G9 1.6,0; G10 2.4,0; G11 3.2,0; G12 4,0; G13 4.8,0; H1 -4.8,-0.8; H2 -4,-0.8; H3 -3.2,-0.8; H4 -2.4,-0.8; H5 -1.6,-0.8; H6 -0.8,-0.8; H7 0,-0.8; H8 0.8,-0.8; H9 1.6,-0.8; H10 2.4,-0.8; H11 3.2,-0.8; H12 4,-0.8; H13 4.8,-0.8; J1 -4.8,-1.6; J2 -4,-1.6; J3 -3.2,-1.6; J4 -2.4,-1.6; J5 -1.6,-1.6; J6 -0.8,-1.6; J7 0,-1.6; J8 0.8,-1.6; J9 1.6,-1.6; J10 2.4,-1.6; J11 3.2,-1.6; J12 4,-1.6; J13 4.8,-1.6; K1 -4.8,-2.4; K2 -4,-2.4; K3 -3.2,-2.4; K4 -2.4,-2.4; K5 -1.6,-2.4; K6 -0.8,-2.4; K7 0,-2.4; K8 0.8,-2.4; K9 1.6,-2.4; K10 2.4,-2.4; K11 3.2,-2.4; K12 4,-2.4; K13 4.8,-2.4; L1 -4.8,-3.2; L2 -4,-3.2; L3 -3.2,-3.2; L4 -2.4,-3.2; L5 -1.6,-3.2; L6 -0.8,-3.2; L7 0,-3.2; L8 0.8,-3.2; L9 1.6,-3.2; L10 2.4,-3.2; L11 3.2,-3.2; L12 4,-3.2; L13 4.8,-3.2; M1 -4.8,-4; M2 -4,-4; M3 -3.2,-4; M4 -2.4,-4; M5 -1.6,-4; M6 -0.8,-4; M7 0,-4; M8 0.8,-4; M9 1.6,-4; M10 2.4,-4; M11 3.2,-4; M12 4,-4; M13 4.8,-4; N1 -4.8,-4.8; N2 -4,-4.8; N3 -3.2,-4.8; N4 -2.4,-4.8; N5 -1.6,-4.8; N6 -0.8,-4.8; N7 0,-4.8; N8 0.8,-4.8; N9 1.6,-4.8; N10 2.4,-4.8; N11 3.2,-4.8; N12 4,-4.8; N13 4.8,-4.8
DIL40 = drill 0.813 octagon: 1 -24.13,-7.62; 2 -21.59,-7.62; 3 -19.05,-7.62; 4 -16.51,-7.62; 5 -13.97,-7.62; 6 -11.43,-7.62; 7 -8.89,-7.62; 8 -6.35,-7.62; 9 -3.81,-7.62; 10 -1.27,-7.62; 11 1.27,-7.62; 12 3.81,-7.62; 13 6.35,-7.62; 14 8.89,-7.62; 15 11.43,-7.62; 16 13.97,-7.62; 17 16.51,-7.62; 18 19.05,-7.62; 19 21.59,-7.62; 20 24.13,-7.62; 21 24.13,7.62; 22 21.59,7.62; 23 19.05,7.62; 24 16.51,7.62; 25 13.97,7.62; 26 11.43,7.62; 27 8.89,7.62; 28 6.35,7.62; 29 3.81,7.62; 30 1.27,7.62; 31 -1.27,7.62; 32 -3.81,7.62; 33 -6.35,7.62; 34 -8.89,7.62; 35 -11.43,7.62; 36 -13.97,7.62; 37 -16.51,7.62; 38 -19.05,7.62; 39 -21.59,7.62; 40 -24.13,7.62
DRY6 = smd 0.55 x 0.3: 1 -0.355,0.5 | smd 0.52 x 0.3: 2 -0.37,0; 3 -0.37,-0.5; 4 0.37,-0.5; 5 0.37,0; 6 0.37,0.5
742-8 = smd 0.5 x 0.9: 1 -1.2,-0.9; 2 -0.4,-0.9; 3 0.4,-0.9; 4 1.2,-0.9; 5 1.2,0.9; 6 0.4,0.9; 7 -0.4,0.9; 8 -1.2,0.9
XQFN16V2 = smd 0.65 x 0.22: 1 -0.825,0.7 | smd 0.55 x 0.22: 2 -0.875,0.3; 3 -0.875,-0.1; 4 -0.875,-0.5; 9 0.675,-0.5; 10 0.675,-0.1; 11 0.675,0.3; 12 0.675,0.7 | smd 0.22 x 0.55: 5 -0.7,-1.075; 6 -0.3,-1.075; 7 0.1,-1.075; 8 0.5,-1.075; 13 0.5,1.275; 14 0.1,1.275; 15 -0.3,1.275; 16 -0.7,1.275
56TVSOP_SMALL = smd 1.676 x 0.178: 1 -2.87,5.4; 2 -2.87,5; 3 -2.87,4.6; 4 -2.87,4.2; 5 -2.87,3.8; 6 -2.87,3.4; 7 -2.87,3; 8 -2.87,2.6; 9 -2.87,2.2; 10 -2.87,1.8; 11 -2.87,1.4; 12 -2.87,1; 13 -2.87,0.6; 14 -2.87,0.2; 15 -2.87,-0.2; 16 -2.87,-0.6; 17 -2.87,-1; 18 -2.87,-1.4; 19 -2.87,-1.8; 20 -2.87,-2.2; 21 -2.87,-2.6; 22 -2.87,-3; 23 -2.87,-3.4; 24 -2.87,-3.8; 25 -2.87,-4.2; 26 -2.87,-4.6; 27 -2.87,-5; 28 -2.87,-5.4; 29 2.87,-5.4; 30 2.87,-5; 31 2.87,-4.6; 32 2.87,-4.2; 33 2.87,-3.8; 34 2.87,-3.4; 35 2.87,-3; 36 2.87,-2.6; 37 2.87,-2.2; 38 2.87,-1.8; 39 2.87,-1.4; 40 2.87,-1; 41 2.87,-0.6; 42 2.87,-0.2; 43 2.87,0.2; 44 2.87,0.6; 45 2.87,1; 46 2.87,1.4; 47 2.87,1.8; 48 2.87,2.2; 49 2.87,2.6; 50 2.87,3; 51 2.87,3.4; 52 2.87,3.8; 53 2.87,4.2; 54 2.87,4.6; 55 2.87,5; 56 2.87,5.4
DHVQFN-EP = smd 0.26 x 0.86: 1 -0.25,2.185; 10 -0.25,-2.185; 11 0.25,-2.185; 20 0.25,2.185 | smd 0.86 x 0.26: 2 -1.185,1.75; 3 -1.185,1.25; 4 -1.185,0.75; 5 -1.185,0.25; 6 -1.185,-0.25; 7 -1.185,-0.75; 8 -1.185,-1.25; 9 -1.185,-1.75; 12 1.185,-1.75; 13 1.185,-1.25; 14 1.185,-0.75; 15 1.185,-0.25; 16 1.185,0.25; 17 1.185,0.75; 18 1.185,1.25; 19 1.185,1.75 | smd 1 x 3: 21 0,0
DGV20_SMALL = smd 1.676 x 0.178: 1 -2.819,1.8; 2 -2.819,1.4; 3 -2.819,1; 4 -2.819,0.6; 5 -2.819,0.2; 6 -2.819,-0.2; 7 -2.819,-0.6; 8 -2.819,-1; 9 -2.819,-1.4; 10 -2.819,-1.8; 11 2.819,-1.8; 12 2.819,-1.4; 13 2.819,-1; 14 2.819,-0.6; 15 2.819,-0.2; 16 2.819,0.2; 17 2.819,0.6; 18 2.819,1; 19 2.819,1.4; 20 2.819,1.8
QFN50P300X300X100-16N = smd 0.84 x 0.26: 1 -1.435,0.75; 2 -1.435,0.25; 3 -1.435,-0.25; 4 -1.435,-0.75; 9 1.435,-0.75; 10 1.435,-0.25; 11 1.435,0.25; 12 1.435,0.75 | smd 0.26 x 0.84: 5 -0.75,-1.435; 6 -0.25,-1.435; 7 0.25,-1.435; 8 0.75,-1.435; 13 0.75,1.435; 14 0.25,1.435; 15 -0.25,1.435; 16 -0.75,1.435

### Placement (x,y rotation side)
50MHZ  5.93,42.16 180 top
AUD  20.6,45.49 270 top
AUDIN  20.6,36.6 90 top
C1  19.85,2.74 270 top
C2  4.87,2.79 270 top
C3  7.2,0.84 180 top
C4  7.03,45.92 180 top
C5  1.61,23.11 90 top
C6  1.61,41.4 270 top
C7  4.74,12.19 90 top
C8  14.29,7.37 90 top
C9  15.58,43.89 0 top
C10  15.58,42.67 0 top
C29  5.22,44.2 180 top
CN1  9.08,41.5 180 bottom
COMP1  6.28,16 0 top
COMP2  9.23,13.21 0 top
FB1  1.61,19.05 90 top
JP1  20.6,9.93 270 top
JP2  20.6,20.09 270 top
JP4  20.6,28.98 90 top
JTAG  5.93,48.01 0 top
L1  9.87,2.84 270 top
MAX10  10.8,24 0 top
POKEYMAX3  10.63,26.42 270 top
R1  1.61,34.54 90 top
R2  11.44,7.37 270 top
R3  12.87,7.37 90 top
R4  1.61,31.52 270 top
R5  1.61,27.1 270 top
R6  1.11,49.99 270 top
R7  1.56,45.72 270 top
R8  12.23,41.5 180 bottom
R9  12.23,40.13 180 bottom
R10  11.93,38.25 0 bottom
R11  15.28,43.28 90 bottom
REG1  7.2,2.64 270 top
RN1  8.37,38.03 0 bottom
RN4  15.38,39.32 270 bottom
RN6  15.13,46.38 180 top
RN7  14.52,49.83 0 top
U$1  15.08,2.24 0 top
U$2  11.01,35.26 90 top
U$4  7.49,8.64 90 top
U$5  13.7,13.56 90 top
U$6  11.01,44.2 0 top

### Tracks (layer width: path | path; a pad name or v marks a point on that pad's centre or on a via)
3V3  (via drill 0.2, 0.5, 0.7)
  Top 0.229: U$1.15 14.78,4.01
  Top 0.241: U$5.20 11.9,16.79 11.62,17.07 11.32,17.07 11.16,16.92 v11.16,16.46
  Top 0.254: v14.21,5.18 14.21,4.57 14.78,4.01 | U$2.17 12.01,33.98 11.71,34.29 9.03,34.29 8.57,34.75 v8.57,34.9
  Top 0.305: C3.1 7.7,0.99 7.73,0.99 7.96,1.22 7.96,2.01 REG1.6 7.83,2.27 8.27,1.83 9.8,1.83 L1.2 | R3.1 C8.1 v15.43,6.71 | MAX10.C6 v10.4,26.8 MAX10.C7 | MAX10.B9 v12.8,27.6 | MAX10.E7 MAX10.F7 | MAX10.F7 v10.4,24.4 MAX10.G6 MAX10.H7 | MAX10.F7 MAX10.G8 | MAX10.F2 v7.2,24.4 MAX10.G3 | MAX10.K3 v7.2,22 MAX10.J3 | MAX10.L6 v10.4,20.4 MAX10.L7 MAX10.L8 | MAX10.F11 v13.6,24.4 MAX10.G11 | MAX10.J11 v13.6,22.8 MAX10.H11 | R6.2 v1.11,48.31 | R5.1 1.61,29.21 v1.56,29.26 1.61,29.31 R4.2 | C6.1 1.61,43.54 v1.56,43.59 R7.2 | MAX10.D8 v11.2,26.8 MAX10.C8 | C29.1 5.98,44.16 5.98,43.28 6.45,42.81 50MHZ.1 50MHZ.4 6.91,41.16 v5.83,40.34
  Top 0.406: FB1.1 1.61,17.42 v1.72,17.07
  Top 0.61: L1.2 11.38,1.9 v11.77,2.44
  Route2 0.305: v15.43,6.71 15.74,6.86 | v1.11,48.31 1.11,48.01 | v8.57,34.9 12.08,35.36
  pour Route2: 0.19,0 4.31,0 4.46,0.15 4.46,4.42 4.31,4.57 11.47,4.57 11.77,4.27 11.77,-0.15 21.38,-0.3 21.22,52.12 0.19,52.12 0.04,51.97
3V3A  (via drill 0.2, 0.6)
  Top 0.305: MAX10.D10 v12.8,26 | v8.8,26 MAX10.D4 | v8.8,22 MAX10.K4 | v12,22 MAX10.K9
  Top 0.406: FB1.2 1.61,20.64 v2.38,21.25 1.61,21.86 C5.1
  Route2 0.305: v12.8,26 11.2,26 9.4,24.2 | v8.8,26 8.8,25.2 9.4,24.6 9.4,24.2 | v8.8,22 8.8,23.4 9.4,24 9.4,24.2
  Route2 0.406: v12,22 9.34,22 | 9.34,22 v8.8,22 | 9.34,22 8.54,21.2 5.6,21.2 5.4,21.4 2.38,21.4 v2.38,21.25
5V0  (via drill 0.2, 0.5, 0.6, 0.7)
  Top 0.229: U$1.14 15.18,4.22
  Top 0.254: 15.18,4.22 v15.13,4.62 | COMP2.2 7.65,13.61 v7.61,13.56 | COMP1.2 v4.61,16.41
  Top 0.305: REG1.3 6.7,3.09 6.13,3.66 5.08,3.66 C2.1 | REG1.5 7.2,1.68 v7.2,1.63 | v9.03,45.72 7.88,45.72 C4.1 | U$6.2 8.82,44.45 v8.57,44.2
  Top 0.406: C7.1 3.68,10.58 POKEYMAX3.17 4.03,8.89 U$4.20
  Top 0.61: v19.85,4.57 C1.1 | 5.08,3.66 5.22,3.66 v5.68,4.42
  Route2 0.305: 1.11,14.33 0.95,14.48 0.7,14.73 0.7,37.54 2.32,39.17 5.98,39.17 7.96,41.15 7.96,43.74 8.42,44.2 v8.57,44.2 8.63,44.25 8.63,45.32 v9.03,45.72
  Route2 0.406: v7.61,13.56 7.3,13.56 6.4,14.47 | 0.95,14.48 1.56,13.87 3.54,13.87 4.31,13.11 5.04,13.11 6.4,14.47 | 6.4,14.47 6.3,14.47 4.92,15.85 4.92,16.1 v4.61,16.41
  Route2 0.61: 5.68,7.01 v5.68,4.42 | v5.68,4.42 4.92,3.66 1.87,3.66 1.11,4.27 1.11,8.84 | v15.13,4.62 15.02,4.62 14.52,4.12 12.23,4.12 11.62,4.72 5.98,4.72 v5.68,4.42 | POKEYMAX3.17 2.17,9.91 1.11,8.84 | 1.11,8.84 1.11,14.33
  Bottom 0.61: 5.83,4.27 v5.68,4.42 5.68,2.13 6.19,1.63 v7.2,1.63 | v19.85,4.57 18.94,3.66 16.09,3.66 v15.13,4.62
AMPIN1M  (via drill 0.2)
  Top 0.203: RN6.1 RN7.4 15.74,48.95 15.74,49.53 15.43,49.84 v15.13,49.84 | U$6.16 10.26,46.16 9.79,46.63 9.79,48.92 v10.25,49.38
  Bottom 0.203: v15.13,49.84 12.08,49.84 11.62,49.38 v10.25,49.38
AMPIN1P  (via drill 0.2)
  Top 0.203: U$6.1 9.56,44.96 8.27,44.96 7.81,44.5 7.81,43.89 8.57,43.13 8.57,40.79 v7.61,39.83
  Bottom 0.203: RN1.5 7.17,39.39 v7.61,39.83 7.88,40.09 CN1.8
AMPIN2M  (via drill 0.2)
  Top 0.203: RN7.3 RN6.2 15.53,46.73 v15.13,46.33 | U$6.5 10.26,43.45 10.4,43.59 v10.4,44.81
  Bottom 0.203: v15.13,46.33 13.45,48.01 12.99,48.01 12.69,47.7 12.69,47.4 10.4,45.11 v10.4,44.81
AMPIN2P  (via drill 0.2)
  Top 0.203: U$6.4 9.5,43.45 9.18,43.13 9.18,40.59 v8.42,39.83
  Bottom 0.203: 8.95,40.96 CN1.7 8.7,40.11 v8.42,39.83 7.97,39.38 RN1.6
AMPIN3M  (via drill 0.2)
  Top 0.203: RN7.2 RN6.3 14.73,46.84 14.36,46.48 13.75,46.48 v13.09,45.57 | U$6.8 11.76,41.92 11.93,41.76 12.69,41.76 13.15,42.22 13.15,43.18 v13.4,43.43
  Bottom 0.203: v13.4,43.43 13.4,43.79 13.15,44.04 13.15,45.52 v13.09,45.57
AMPIN3P  (via drill 0.2)
  Top 0.203: v12.38,42.37 12.38,43.38 U$6.9
  Bottom 0.203: RN4.5 RN4.6 13.7,38.92 13.15,39.47 13.15,40.12 R9.2 12.69,40.27 12.69,40.54 12.23,41 12.23,42.22 v12.38,42.37
AMPIN4P  (via drill 0.2)
  Top 0.203: 12.52,44.95 U$6.12 12.4,44.95 12.23,45.11 12.23,45.57 v12.84,46.18
  Bottom 0.203: 13.91,41.45 14.63,40.73 RN4.8 RN4.7 | 13.91,41.45 13.19,41.45 R8.2 | v12.84,46.18 14.36,46.18 14.82,45.72 15.28,45.72 16.19,44.81 16.19,43.43 16.04,43.28 14.52,43.28 14.36,43.13 14.36,41.91 13.91,41.45
AUD1  (via drill 0.2)
  Top 0.152: MAX10.C11 v14.4,26.8
  Bottom 0.152: v14.4,26.8 14.8,27.33 15.43,27.33 15.89,27.79 15.89,29.87 15.74,30.02 15.74,33.22 15.89,33.38 15.89,34.14 15.43,34.59 9.79,34.59 8.88,35.51 8.57,35.51 8.12,35.97 7.51,35.97 7.17,36.3 RN1.4
AUD2  (via drill 0.2)
  Top 0.152: MAX10.C12 v15.2,26.8
  Bottom 0.152: v15.2,26.8 15.89,26.8 | 15.89,26.8 16.02,26.8 | 15.89,26.8 16.19,27.11 16.19,34.29 15.58,34.9 9.95,34.9 9.03,35.81 8.73,35.81 7.97,36.57 RN1.3
AUD3  (via drill 0.2)
  Top 0.152: MAX10.D11 v14.4,26
  Bottom 0.152: v14.4,26 15.2,25.2 15.64,25.2 16.8,26.36 16.8,34.59 15.89,35.51 10.25,35.51 9.57,36.19 RN1.1
AUD4  (via drill 0.2)
  Top 0.152: MAX10.D12 v15.2,26
  Bottom 0.152: v15.2,26 16,26 16,26.02 16.5,26.52 16.5,34.44 15.74,35.2 10.1,35.2 9.18,36.12 8.88,36.12 8.77,36.23 RN1.2
AUDF1  (via drill 0.2)
  Top 0.203: POKEYMAX3.37 18.25,43.56 RN6.8 17.26,46.41 17.26,49.38 17.41,49.53 17.41,50.14 17.26,50.29 17.26,50.9 17.87,51.51 19.09,51.51 20.6,50 AUD.1 | U$6.15 10.76,46.73 v10.71,46.79
  Bottom 0.203: v10.71,46.79 11.47,46.79 12.23,47.55 12.23,48.31 12.69,48.77 16.96,48.77 17.26,49.07 20.37,49.07 AUD.1
AUDF2  (via drill 0.2)
  Top 0.203: U$6.6 10.76,41.09 11.16,40.69 13.6,40.69 14.82,41.91 15.43,41.91 15.58,42.06 15.58,44.5 15.43,44.65 15.43,45.38 RN6.7 15.53,45.97 v15.89,46.33
  Bottom 0.203: v15.89,46.33 17.11,46.33 17.56,46.79 20.57,46.79 AUD.2
AUDF3  (via drill 0.2)
  Top 0.203: C10.2 16.8,42.67 v17.11,42.37
  Bottom 0.203: AUD.3 20.31,43.93 20.31,42.98 19.09,41.76 17.72,41.76 v17.11,42.37
AUDF4  (via drill 0.2)
  Top 0.203: v17.11,43.89 C9.2
  Bottom 0.203: 20.52,41.6 AUD.4 20.22,41.3 16.96,41.3 16.35,41.91 16.35,42.67 16.65,42.98 16.65,43.43 v17.11,43.89
AUDIN3
  Bottom 0.203: AUDIN.3 19.57,39.14 19.39,39.32 17.56,39.32 | 17.56,39.32 17.26,39.01 16.53,39.01 RN4.3 | 17.56,39.32 17.41,39.47 17.26,40.23 17.13,40.52 RN4.1 16.59,40.6 15.58,41.6 15.58,42.33 R11.1
AUDIN4
  Bottom 0.152: R10.1 13.3,38.25 14.36,37.19 15.11,37.19 16.04,38.12
  Bottom 0.203: AUDIN.2 20.6,37.81 19.85,38.56 19.09,38.56 18.78,38.86 18.02,38.86 17.26,38.1 16.45,38.1 RN4.4 16.04,38.12 15.72,38.12 15.43,38.41 15.43,39.32 15.74,39.62 16.34,39.62 RN4.2 15.95,39.72
CONF_DONE  (via drill 0.2)
  Top 0.152: MAX10.C5 v8.8,26.8 | R5.2 1.69,26.36 5.16,26.36 v5.25,26.4
  Bottom 0.152: v8.8,26.8 8.2,26.8 7.4,26 7.2,26 6.8,26.4 v5.25,26.4
FAKE_CLK
  Top 0.203: MAX10.H8 MAX10.G9
GND  (via drill 0.2, 0.25, 0.5, 0.6, 0.7)
  Top 0.152: U$2.8 8.41,33.62 v8.57,33.78 | U$2.19 12.81,33.6 v12.99,33.78 | U$2.38 12.81,37.21 12.99,37.03 13.3,37.03 v13.45,36.88
  Top 0.241: COMP2.11 10.75,13.61 11.01,13.87 v11.01,14.17 11.77,14.17 12.3,14.7 U$5.19
  Top 0.254: U$5.10 16.32,10.7 v16.85,10.67 | COMP1.11 8.21,16.4 | U$1.6 14.78,0.56 | 13.91,3.96 13.92,3.96 U$1.16 | U$4.19 4.7,9.82 v4.61,9.91 | U$2.49 8.41,35.96 v7.96,35.36 | U$2.55 6.01,36 v5.83,35.81 5.61,36.03 U$2.56
  Top 0.305: v5.6,19.6 MAX10.N1 | v9.6,20.4 MAX10.M6 | v8,22 MAX10.J4 | v16,18.8 MAX10.N13 | v11.2,23.6 MAX10.G7 | v13.6,25.2 MAX10.E11 | v9.6,26 MAX10.D5 | v8,24.4 MAX10.F3 | v7.2,26.8 MAX10.C3 | MAX10.L9 v12,21.2 | MAX10.H12 v14.4,23.6 | MAX10.B8 v11.2,27.6 | v5.6,28.4 MAX10.A1 | 14.78,0.56 14.67,0.56 12.69,0.56 v12.23,0.91 | C8.2 15.44,8.07 v15.43,7.92 | 8.21,16.4 v8.27,16.46 | U$4.10 9.68,7.43 | 13.91,3.96 12.99,4.88 v12.99,5.33 | C7.2 4.74,14 v4.76,14.02 | MAX10.A13 15.6,29.39 v15.41,29.59 | 50MHZ.2 4.88,44.04 C29.2 4.92,44.39 v4.92,45.72 | 6.38,46.11 C4.2 6.38,45.78 v7.2,44.81 | RN7.6 RN7.5 16.62,49.84 v16.65,49.84 | RN6.6 RN6.5 13.93,44.52 v13.86,44.45 v13.85,44.45 U$6.11
  Top 0.356: REG1.4 6.32,2.27 | REG1.1 8.32,3
  Top 0.406: 4.86,2.27 C2.2 4.86,0.86 v4.92,0.86 | C1.2 v19.85,0.86 | v4.92,0.86 6.55,0.86 C3.2 | 6.32,2.27 v4.92,0.86 | 8.32,3 v8.42,2.9 | U$4.2 U$4.3 U$4.4 U$4.5 U$4.6 U$4.7 U$4.8 U$4.9 9.66,7.45 v10.25,6.86 | 10.1,6.71 v10.25,6.86 | R1.2 1.61,36.37 v1.77,36.42 | R2.2 10.39,6.72 v10.25,6.86 | 9.68,7.43 v10.25,6.86 | C5.2 1.61,24.94 v1.72,24.99 | C6.2 1.61,39.83 v1.56,39.78
  Route15 0.203: v13.86,44.45 13.91,44.65
  Route15 0.305: v12.23,0.91 12.25,0.91 12.2,0.86 | v8.57,33.78 8.57,34.14 | v7.96,35.36 8.57,36.58 | v12.99,33.78 12.99,34.14 | v7.2,44.81 7.35,44.96
  Route15 0.406: v19.85,0.86 20,1.98 | v8.42,2.9 8.57,2.74 | 11.32,5.79 11.16,5.64 | v1.72,24.99 1.72,24.23 1.56,24.08
  Route15 0.61: v4.92,0.86 12.2,0.86 12.64,0.86 12.69,0.91 v12.23,0.91
  Bottom 0.152: R10.2 11.28,39.21 v10.99,39.37
  Bottom 0.203: R11.2 15.28,44.35 14.97,44.65 14.06,44.65 v13.86,44.45 | 7.2,44.2 7.96,43.43 7.96,42.35 CN1.1
  Bottom 0.305: CN1.1 CN1.2 CN1.3 CN1.4 | 7.2,44.2 v7.2,44.81
  pour Route15 (isolate 0.356, rank 6): 0.06,51.99 21.11,51.84 21.01,3.86 21.01,0.2 12.35,0.2 11.23,4.61 3.9,4.63 3.9,0.14 -0.01,-0.02 0.09,13.67
  pour Route15 (isolate 0.203): 11.01,0.3 10.71,4.11 4.46,4.11 4.46,0.46
IOX_INT  (via drill 0.2)
  Top 0.152: U$1.11 16.14,2.54 16.35,2.74 16.35,5.79 16.96,6.4 16.96,9.14 16.8,9.3 v16.8,9.75 | MAX10.M7 v11.2,19.6
  Bottom 0.152: v11.2,19.6 11.6,19.2 11.6,18.57 10.4,17.37 10.4,16.31 11.01,15.7 11.62,15.7 12.54,14.78 12.54,14.17 13.6,13.11 13.6,12.8 v16.8,9.75
IOX_RST  (via drill 0.2)
  Top 0.152: U$1.1 14.02,2.94 13.75,3.2 13.75,3.5 12.18,5.08 12.18,9.25 12.38,9.45 14.52,9.45 v14.67,9.3 | MAX10.M3 v8,19.6
  Bottom 0.152: v14.67,9.3 13.75,9.3 12.38,10.67 12.38,12.62 11.6,13.4 11.62,13.42 11.62,14.33 11.16,14.78 10.4,14.78 10,15.19 10,15.2 9,16.2 9,16.8 8.4,17.4 8.4,19.2 v8,19.6
IOX_SCL  (via drill 0.2)
  Top 0.152: U$1.12 15.78,2.94 16.04,3.2 16.04,5.94 16.65,6.55 16.65,8.84 v16.19,9.3 | MAX10.M5 v9.6,19.6
  Bottom 0.152: v16.19,9.3 15.58,9.91 15.49,9.91 13.2,12.2 13.2,13 12.23,13.97 12.23,14.63 11.47,15.39 10.86,15.39 10,16.25 10,19.2 v9.6,19.6
IOX_SDA  (via drill 0.2)
  Top 0.152: U$1.13 15.58,3.8 15.74,3.96 15.74,6.1 16.35,6.71 16.35,8.23 v15.58,8.99 | MAX10.M4 v8.8,19.6
  Bottom 0.152: v15.58,8.99 15.58,9.3 12.8,12.08 12.8,12.8 11.93,13.67 11.93,14.48 11.32,15.09 10.71,15.09 10.2,15.6 9.4,16.4 9.4,19 v8.8,19.6
K0
  Top 0.152: U$1.9 16.56,1.74 16.96,2.13 16.96,5.03 18.02,6.1 18.18,6.25 18.25,6.33 POKEYMAX3.23
K1
  Top 0.152: U$1.8 15.58,1.07 15.74,0.91 16.8,0.91 17.26,1.37 17.26,2.74 18.25,3.73 POKEYMAX3.22
K2
  Top 0.152: U$1.7 15.18,0.71 15.43,0.46 17.41,0.46 18.25,1.29 POKEYMAX3.21
K3
  Top 0.152: POKEYMAX3.20 3.01,3.28 4.92,5.18 6.13,5.18 6.9,4.42 11.01,4.42 12.54,2.9 12.54,1.98 13.45,1.07 14.28,1.07 U$1.5
K4
  Top 0.152: U$1.4 13.24,1.74 12.84,2.13 12.84,3.05 11.16,4.72 7.05,4.72 6.29,5.49 4.76,5.49 4.1,4.83 POKEYMAX3.19
  Route2 0.61: POKEYMAX3.19 3.04,4.83
K5
  Top 0.152: POKEYMAX3.18 3.01,6.48 3.7,5.79 6.44,5.79 7.2,5.03 11.32,5.03 13.15,3.2 13.15,2.44 13.45,2.13 U$1.3
KR1
  Top 0.152: U$1.10 16.35,2.13 16.65,2.44 16.65,5.64 17.26,6.25 17.26,8.84 17.41,8.99 17.41,10.36 18.18,11.12 18.18,12.37 POKEYMAX3.25
KR2  (via drill 0.2)
  Top 0.152: U$1.2 13.66,2.54 13.45,2.74 13.45,3.35 11.47,5.33 7.35,5.33 6.59,6.1 4.61,6.1 v4,6.71 | v3.09,8.69 2.48,8.69 2.02,9.14 2.02,11.46 POKEYMAX3.16
  Bottom 0.152: v4,6.71 4,7.77 v3.09,8.69
LIN0  (via drill 0.2)
  Top 0.152: MAX10.B1 v6.4,28.4 | U$2.2 6.01,33.59 v6.2,33.78
  Bottom 0.152: v6.2,33.78 6.2,28.6 v6.4,28.4
LIN1
  Top 0.152: MAX10.A2 6.8,30.2 6.71,30.29 6.6,30.4 6.41,30.59 U$2.3
LIN2  (via drill 0.2)
  Top 0.152: MAX10.B2 v7.2,28.4 | U$2.4 6.81,33.59 v7,33.78
  Bottom 0.152: v7,33.78 7,28.6 v7.2,28.4
LIN3
  Top 0.152: MAX10.A3 7.6,30.2 7.21,30.59 U$2.5
LIN4  (via drill 0.2)
  Top 0.152: MAX10.B3 v8,28.4 | U$2.6 7.61,33.59 v7.8,33.78
  Bottom 0.152: v7.8,33.78 7.8,28.6 v8,28.4
LIN5
  Top 0.152: MAX10.A4 8.4,30.2 8.01,30.59 U$2.7
LIN6  (via drill 0.2)
  Top 0.152: MAX10.B4 v8.8,28.4 | U$2.9 8.81,30.81 v8.8,30.8
  Bottom 0.152: v8.8,28.4 v8.8,30.8
LIN7
  Top 0.152: MAX10.A5 9.2,30.2 9.34,30.34 9.34,31.09 9.21,31.21 U$2.10
LIN8  (via drill 0.2)
  Top 0.152: MAX10.B5 v9.6,28.4 | U$2.11 9.61,33.59 v9.8,33.78
  Bottom 0.152: v9.8,33.78 9.8,28.6 v9.6,28.4
LIN9
  Top 0.152: MAX10.A6 10,29.72 | 10,29.72 10,30.2 | U$2.12 10.01,29.73 10,29.72
LIN10  (via drill 0.2)
  Top 0.152: MAX10.B6 v10.4,28.4 | U$2.13 10.41,33.59 v10.6,33.78
  Bottom 0.152: v10.6,33.78 10.6,28.6 v10.4,28.4
LIN11
  Top 0.152: MAX10.A7 10.8,29.72 | 10.8,29.72 10.8,30.2 | U$2.14 10.81,29.73 10.8,29.72
LIN12  (via drill 0.2)
  Top 0.152: MAX10.B7 v11.2,28.4 | U$2.15 11.21,33.59 v11.4,33.78
  Bottom 0.152: v11.4,33.78 11.4,28.6 v11.2,28.4
LIN13
  Top 0.152: MAX10.A8 11.6,29.57 | 11.6,29.57 11.6,30 | U$2.16 11.61,29.58 11.6,29.57
LIN14
  Top 0.152: MAX10.A9 12.4,30.2 12.41,30.21 U$2.18
LIN15
  Top 0.152: MAX10.A10 13.2,29.57 12.99,29.77 12.99,30.79 13.21,31 U$2.20
LIN16  (via drill 0.2)
  Top 0.152: MAX10.B10 v12.8,28.4 | U$2.21 13.61,33.59 v13.8,33.78
  Bottom 0.152: v13.8,33.78 13.8,32.35 12.8,31.35 v12.8,28.4
LIN17
  Top 0.152: MAX10.A11 14,29.41 13.3,30.11 13.3,30.48 14.01,31.19 U$2.22
LIN18  (via drill 0.2)
  Top 0.152: MAX10.B11 v13.6,28.4 | U$2.23 14.41,33.59 v14.6,33.78
  Bottom 0.152: v14.6,33.78 14.6,32.09 13.6,31.09 v13.6,28.4
LIN19
  Top 0.152: MAX10.A12 14.8,29.41 14.5,29.72 14.21,29.72 13.6,30.33 14.36,31.09 14.52,31.09 14.81,31.38 U$2.24
LIN20  (via drill 0.2)
  Top 0.152: MAX10.B12 v14.4,28.4 | U$2.25 15.21,31.13 v14.38,30.3
  Bottom 0.152: v14.4,28.4 14.4,29.7 v14.38,30.3
LIN21  (via drill 0.2)
  Top 0.152: MAX10.B13 v15.2,28.4 | U$2.26 15.61,33.51 v15.34,33.78
  Bottom 0.152: v15.34,33.78 15.43,33.69 15.43,30.94 14.97,30.48 14.97,30.02 14.82,29.87 14.82,29.41 15.2,29.04 v15.2,28.4
LIN22
  Top 0.152: 15.8,27.2 MAX10.C13 16.19,27.79 16.19,31.24 16.01,31.42 U$2.27
LIN23
  Top 0.152: 15.77,26.4 MAX10.D13 16.5,27.21 16.5,31.39 16.41,31.48 U$2.28
LINB0  (via drill 0.2)
  Top 0.152: MAX10.M9 v12.8,19.6 | U$5.18 12.7,15.05 v13.12,14.63
  Bottom 0.152: v12.8,19.6 12.8,14.95 v13.12,14.63
LINB1  (via drill 0.2)
  Top 0.152: MAX10.M10 v13.6,19.6 | U$5.17 13.1,15.28 13.15,15.24 13.45,15.24 v13.91,14.78
  Bottom 0.152: v13.6,19.6 13.6,15.09 v13.91,14.78
LINB2
  Top 0.152: MAX10.N10 13.2,18.39 13.5,18.08 U$5.16
LINB3  (via drill 0.2)
  Top 0.152: MAX10.M11 v14.4,19.6 | U$5.15 13.91,15.24 14.1,15.24 v14.71,14.63
  Bottom 0.152: v14.4,19.6 14.4,14.94 v14.71,14.63
LINB4
  Top 0.152: MAX10.N11 14,18.35 14.3,18.04 U$5.14
LINB5  (via drill 0.2)
  Top 0.152: MAX10.M12 v15.2,19.6 | U$5.13 14.7,15.3 14.8,15.2 15,15.2 v15.42,14.94
  Bottom 0.152: v15.2,19.6 15.2,15.16 v15.42,14.94
LINB6
  Top 0.152: U$5.12 15.1,18.01 14.8,18.31 MAX10.N12
LINB7  (via drill 0.2)
  Top 0.152: MAX10.M13 v16,19.6 | v15.89,17.83 15.89,16.77 U$5.11
  Bottom 0.152: v16,19.6 16.5,19 16.5,18.54 v15.89,17.83
LVLA0
  Top 0.152: POKEYMAX3.3 3.01,44.42 3.85,43.59 3.85,41.3 4.15,41 4.15,40.08 4.76,39.47 6.13,39.47 6.41,39.2 U$2.54
LVLA1
  Top 0.152: 3.01,42.9 POKEYMAX3.4 3.01,41.68 3.85,40.84 3.85,39.01 4.31,38.56 4.31,36.27 4.61,35.97 4.61,35.36 4.76,35.2 6.29,35.2 6.59,35.51 6.59,36.5 6.82,36.73 6.82,38.05 U$2.53
LVLA2
  Top 0.152: POKEYMAX3.5 3.01,39.4 4,38.41 4,36.12 4.31,35.81 4.31,35.2 4.61,34.9 6.44,34.9 6.9,35.36 6.9,36.27 7.2,36.58 U$2.52
LVLA3
  Top 0.152: POKEYMAX3.6 3.01,36.65 4,35.66 4,35.05 4.46,34.59 6.59,34.59 6.97,34.98 7.2,35.2 7.2,36.12 7.61,36.53 U$2.51
LVLA4
  Top 0.152: POKEYMAX3.7 3.29,35.31 4.31,34.29 6.74,34.29 7.51,35.05 7.51,35.97 7.96,36.42 7.96,37.03 8.01,37.08 U$2.50
LVLA5
  Top 0.152: U$2.48 8.81,39.17 8.66,39.32 7.2,39.32 6.9,39.62 6.9,40.08 7.05,40.23 7.35,40.23 8.12,41 8.12,42.98 6.59,44.5 6.59,44.81 6.44,44.96 5.83,44.96 5.68,45.11 5.68,46.02 5.22,46.48 4,46.48 3.01,47.47 POKEYMAX3.2
LVLA6  (via drill 0.2)
  Top 0.152: U$2.47 9.21,35.18 9.64,34.75 11.77,34.75 12.08,34.44 15.58,34.44 16.5,33.53 16.8,33.53 16.8,26.21 17.41,25.6 17.41,24.69 v18.02,24.08
  Bottom 0.152: v18.02,24.08 18.25,23.85 POKEYMAX3.29
LVLA7
  Top 0.152: POKEYMAX3.30 18.25,25.53 17.11,26.52 17.11,33.68 16.96,33.83 16.65,33.83 15.74,34.75 12.23,34.75 11.93,35.05 9.79,35.05 9.61,35.23 U$2.46
LVLA8
  Top 0.152: U$2.45 10.01,35.59 10.25,35.36 12.08,35.36 12.38,35.05 15.89,35.05 16.8,34.14 17.11,34.14 17.41,33.83 17.41,31.06 POKEYMAX3.32
LVLA9
  Top 0.152: U$2.44 10.41,35.96 10.71,35.66 12.23,35.66 12.54,35.36 16.04,35.36 16.96,34.44 17.26,34.44 17.72,33.98 17.72,33.3 POKEYMAX3.33
LVLA10
  Top 0.152: U$2.43 10.81,36.17 11.01,35.97 12.38,35.97 12.69,35.66 16.19,35.66 17.11,34.75 17.41,34.75 18.48,33.68 18.63,33.68 19.24,33.07 19.24,32.46 18.78,32 18.78,31.09 19.24,30.63 19.24,29.87 18.78,29.41 18.78,28.22 POKEYMAX3.31
LVLA11  (via drill 0.2)
  Top 0.152: U$2.42 11.21,36.73 v11.39,36.55
  Bottom 0.152: POKEYMAX3.24 18.25,10.29 16.8,11.73 16.8,25.91 17.11,26.21 17.11,34.75 16.04,35.81 11.62,35.81 11.39,36.04 v11.39,36.55
LVLA12  (via drill 0.2)
  Top 0.152: U$2.41 11.61,37.04 v12.08,36.58
  Bottom 0.152: 18.12,14.99 POKEYMAX3.26 17.41,15.82 17.41,15.85 17.11,16.15 17.11,25.76 17.41,26.06 17.41,34.9 16.19,36.12 12.54,36.12 v12.08,36.58
LVLA13  (via drill 0.2)
  Top 0.152: U$2.40 12.01,37.1 12.08,37.03 12.31,37.03 v12.77,36.58
  Bottom 0.152: POKEYMAX3.27 18.25,18.52 17.41,19.36 17.41,25.6 19.09,27.28 19.09,28.04 18.78,28.35 18.78,29.57 19.09,29.87 19.09,30.63 18.78,30.94 18.78,32 19.39,32.61 19.39,32.92 18.78,33.53 18.78,34.59 19.39,35.2 19.39,35.51 18.63,36.27 16.5,36.27 16.35,36.42 12.84,36.42 12.77,36.5 v12.77,36.58
LVLA14  (via drill 0.2)
  Top 0.152: U$2.39 12.41,38.99 11.62,39.83 10.83,39.83 v10.25,39.37
  Bottom 0.152: POKEYMAX3.28 18.25,21.41 19.09,22.25 19.09,24.23 19.39,24.54 19.39,25.6 19.09,25.91 19.09,26.82 19.39,27.13 19.39,28.35 19.09,28.65 19.09,29.41 19.55,29.87 19.55,30.63 19.09,31.09 19.09,31.85 19.7,32.46 19.7,33.07 19.09,33.68 19.09,34.44 19.7,35.05 19.7,35.66 18.78,36.58 16.65,36.58 16.5,36.73 14.36,36.73 13.6,37.49 10.86,37.49 10.55,37.8 10.55,38.99 v10.25,39.37
LVLA15
  Top 0.152: U$2.37 13.21,39.54 15.13,41.45 16.96,41.45 17.41,41.91 18.63,41.91 19.24,42.52 19.24,43.28 18.63,43.89 18.63,45.09 POKEYMAX3.38
LVLA16
  Top 0.152: U$2.36 13.61,39.48 15.28,41.15 17.11,41.15 17.56,41.6 18.78,41.6 19.55,42.37 19.55,43.43 19.24,43.74 19.24,47.02 POKEYMAX3.39
LVLA17
  Top 0.152: U$2.35 14.01,39.42 15.43,40.84 17.26,40.84 17.72,41.3 18.94,41.3 19.85,42.22 19.85,43.59 19.55,43.89 19.55,48.62 18.25,49.91 POKEYMAX3.40
LVLA18
  Top 0.152: POKEYMAX3.36 15.43,40.39 14.41,39.37 U$2.34
LVLA19  (via drill 0.2)
  Top 0.152: U$2.33 14.81,39.31 15.43,39.93 17.41,39.93 17.87,39.47 18.18,39.47 v19.7,37.95 | JP4.3 20.6,32.75 v20.61,32.77
  Bottom 0.152: v20.61,32.77 20.46,32.77 19.55,33.68 19.55,34.44 20,34.9 20,35.81 19.55,36.27 19.55,37.8 v19.7,37.95
LVLA20
  Top 0.152: POKEYMAX3.35 18.25,38.48 17.11,39.62 15.58,39.62 15.21,39.25 U$2.32
LVLA21
  Top 0.152: U$2.31 15.61,39.2 15.74,39.32 16.8,39.32 17.11,39.01 17.11,37.19 17.56,36.73 18.63,36.73 19.55,35.81 19.55,33.68 19.85,33.38 19.85,32.16 19.55,31.85 19.55,31.24 20.6,30.19 JP4.2
LVLA22
  Top 0.152: POKEYMAX3.34 17.16,35.31 16.27,36.2 16.19,36.27 16.01,36.45 U$2.30
LVLA23
  Top 0.152: U$2.29 16.41,37.12 17.11,36.42 18.48,36.42 19.24,35.66 19.24,34.59 19.09,34.44 19.09,33.68 19.55,33.22 19.55,32.31 19.09,31.85 19.09,31.24 19.55,30.79 19.55,29.72 19.09,29.26 19.09,27.95 JP4.1
LVLB0
  Top 0.152: U$5.2 12.3,12.27 14.21,14.17 15.43,14.17 16.19,14.94 16.19,16 17.11,16.92 17.11,18.14 17.72,18.75 18.94,18.75 19.24,19.05 19.24,19.36 19.55,19.66 19.55,21.64 20.46,22.55 20.46,23.76 JP2.1
LVLB1
  Top 0.152: U$5.3 12.7,12.21 14.36,13.87 15.58,13.87 16.5,14.78 16.5,15.85 17.41,16.76 17.41,17.98 17.87,18.44 19.09,18.44 19.55,18.9 19.55,19.2 20.46,20.12 20.46,21.22 JP2.2
LVLB2
  Top 0.152: U$5.4 13.1,12.15 14.52,13.56 15.74,13.56 16.8,14.63 16.8,15.7 17.56,16.46 19.24,16.46 20.46,17.68 20.46,18.68 JP2.3
LVLB3
  Top 0.152: U$5.5 13.5,12.09 14.67,13.26 15.89,13.26 17.11,14.48 17.11,15.54 17.72,16.15 20.47,16.15 JP2.4 20.57,16.31
LVLB4
  Top 0.152: U$5.6 13.9,12.04 14.82,12.95 16.04,12.95 17.41,14.33 17.41,15.39 17.87,15.85 18.78,15.85 19.24,15.39 19.24,15.1 JP1.1
LVLB5
  Top 0.152: U$5.7 14.3,11.98 14.97,12.65 16.19,12.65 17.56,14.02 18.94,14.02 19.09,13.87 19.24,13.72 19.85,13.11 19.85,11.89 20.4,11.34 JP1.2
LVLB6
  Top 0.152: U$5.8 14.7,11.92 15.13,12.34 16.35,12.34 17.72,13.72 18.78,13.72 19.55,12.95 19.55,11.89 19.39,11.73 19.39,10.67 19.55,10.52 19.55,9.51 JP1.3
LVLB7
  Top 0.152: U$5.9 15.1,11.87 15.28,12.04 16.5,12.04 17.87,13.41 18.63,13.41 19.24,12.8 19.24,12.04 19.09,11.89 19.09,10.52 19.24,10.36 19.24,8.08 19.55,7.77 19.55,6.97 JP1.4
N$1
  Bottom 0.203: 9.57,39.25 RN1.8 9.57,39.4 10.29,40.12 CN1.5 10.89,40.13 R9.1
N$2
  Bottom 0.203: R8.1 11.58,41.45 9.79,41.45 9.71,41.37 CN1.6 9.46,40.06 8.77,39.37 RN1.7
N$5  (via drill 0.2)
  Top 0.203: v11.62,44.65 11.26,44.71 U$6.14 11.26,46.43 12.23,47.4 12.23,50.14 12.69,50.6 13.18,50.6 RN7.8 | C9.1 13.75,42.71 v13.75,42.67
  Bottom 0.203: v11.62,44.65 11.62,43.74 12.38,42.98 12.84,42.98 13.15,42.67 v13.75,42.67
N$6  (via drill 0.2)
  Top 0.203: RN7.7 14.06,50.68 14.06,49.99 13.91,49.84 12.99,49.84 12.69,49.53 12.69,48.31 13.3,47.7 v13.3,47.4 | v11.01,44.2 11.01,43.59 11.26,43.34 U$6.7 11.26,41.35 11.47,41.15 13.45,41.15 14.63,42.33 14.93,42.33 C10.1
  Bottom 0.203: v11.01,44.2 11.01,45.11 v13.3,47.4
N$22
  Top 0.203: RN7.1 RN6.4 13.43,46.79 12.99,46.79 12.84,46.94 12.54,46.94 11.76,46.16 U$6.13
N$137
  Top 0.305: REG1.2 7.2,3.5 7.51,3.81 9.85,3.81 L1.1
NSTATUS  (via drill 0.2)
  Top 0.152: MAX10.C4 v8,27.6 | v5.37,31.09 5.07,31.39 2.93,31.39 2.17,32.16 1.63,32.16 R4.1
  Bottom 0.152: v8,27.6 5.36,27.6 5.07,27.89 5.07,30.79 v5.37,31.09
OSC_CLOCK  (via drill 0.2)
  Top 0.152: MAX10.H6 v9.6,22.8 | v8,22.8 MAX10.H4 | 50MHZ.3 4.96,41.16 v5.8,42
  Bottom 0.152: v8,22.8 v9.6,22.8 11.4,22.8 12.2,23.6 12.2,33.83 | 12.2,34 12.2,33.83 | 5.77,42 v5.8,42 5.22,41.42 5.22,34.9 5.83,34.29 11.74,34.29 12.2,33.83
PIN0
  Top 0.152: COMP1.13 6.53,17.31 6.9,17.68 7.51,17.68 8.4,18.57 MAX10.N4
PIN1
  Top 0.152: COMP1.12 7.85,16.8 9.2,18.15 MAX10.N5
PIN2
  Top 0.152: COMP1.14 6.03,17.42 6.59,17.98 7.05,17.98 7.6,18.53 MAX10.N3
PIN3
  Top 0.152: COMP1.1 5.39,17.39 6.8,18.8 MAX10.N2
PIN4
  Top 0.152: COMP2.13 9.48,14.63 10.1,15.24 10.1,16.92 11.62,18.44 11.62,19.18 MAX10.N8
PIN5
  Top 0.152: COMP2.12 10.12,14.35 10.4,14.63 10.4,16.76 12.38,18.75 12.38,19.18 MAX10.N9
PIN6
  Top 0.152: COMP2.14 8.98,14.58 9.79,15.39 9.79,17.07 10.33,17.6 10.71,17.98 10.8,18.08 MAX10.N7
PIN7
  Top 0.152: COMP2.1 8.35,14.41 9.49,15.54 9.49,17.22 10,17.73 MAX10.N6
POT0  (via drill 0.2)
  Top 0.152: COMP2.10 11.21,13.21 11.47,12.95 11.47,11.43 v10.86,10.82 9.68,9.64 U$4.11
  Bottom 0.152: POKEYMAX3.12 3.34,22.61 5.07,20.88 5.07,17.53 6.59,16 7.96,16 9.95,14.02 9.95,11.73 v10.86,10.82
POT1  (via drill 0.2)
  Top 0.152: COMP2.8 10.12,10.84 v10.1,10.82 9.24,9.97 U$4.12
  Bottom 0.152: POKEYMAX3.13 4.21,20.07 4.76,19.51 4.76,17.37 6.74,15.39 6.74,12.5 7.51,11.73 9.18,11.73 v10.1,10.82
POT2  (via drill 0.2)
  Top 0.152: COMP2.6 8.98,11.17 v9.34,10.82 8.74,10.23 U$4.13
  Bottom 0.152: POKEYMAX3.14 4.15,17.53 6.44,15.24 6.44,12.34 7.35,11.43 8.73,11.43 v9.34,10.82
POT3  (via drill 0.2)
  Top 0.152: COMP2.4 7.82,12.81 7.67,12.95 7.05,12.95 6.9,12.8 6.9,12.34 7.96,11.28 8.12,11.28 v8.57,10.82 8.24,10.49 U$4.14
  Bottom 0.152: POKEYMAX3.8 2.63,32.77 0.5,30.63 0.5,11.43 1.11,10.82 4.76,10.82 5.98,9.6 8.02,9.6 U$4.14 8.24,10.49 v8.57,10.82
POT4  (via drill 0.2)
  Top 0.152: COMP1.10 7.96,16 8.12,15.85 8.73,15.85 8.88,15.7 8.88,15.39 7.81,14.33 7.51,14.33 6.59,13.41 6.59,12.19 7.81,10.97 v7.81,10.82 7.74,10.75 U$4.15
  Bottom 0.152: POKEYMAX3.9 1.46,30.23 0.8,29.57 0.8,11.58 1.26,11.12 4.92,11.12 6.13,9.91 7.2,9.91 v7.81,10.82
POT5  (via drill 0.2)
  Top 0.152: COMP1.8 7.2,15.16 7.2,14.63 6.29,13.72 6.29,11.73 v7.2,10.82 7.24,10.78 U$4.16
  Bottom 0.152: POKEYMAX3.10 1.66,27.69 1.11,27.13 1.11,11.73 1.41,11.43 5.07,11.43 6.29,10.21 6.59,10.21 v7.2,10.82
POT6
  Top 0.152: U$4.17 6.74,10.82 5.98,11.58 5.98,14.02 6.03,14.06 6.03,14.17 | POKEYMAX3.15 3.2,14.8 3.68,14.8 3.85,14.63 5.57,14.63 6.03,14.17 | COMP1.6 6.03,14.17
POT7
  Top 0.152: U$4.18 6.24,10.71 5.68,11.28 5.68,11.92 5.4,12.2 4.2,12.2 4,12.4 4,13.2 3.6,13.6 2.9,13.6 2.02,14.48 2.02,15.54 2.48,16 3.24,16 | POKEYMAX3.11 3.39,25.15 5.22,23.32 5.22,20.42 4.92,20.12 4.92,17.68 3.24,16 | COMP1.4 4.82,15.6 4.76,15.54 3.7,15.54 3.24,16
POTRESET  (via drill 0.2)
  Top 0.152: MAX10.M2 v6.4,19.6 | U$4.1 5.15,8.23 2.17,8.23 1.72,8.69 1.72,15.79 2.32,16.4 3.18,16.4 4.15,17.37 4.15,21.43 v4.76,22.13
  Bottom 0.152: v6.4,19.6 6.4,20 6,20.4 6,20.99 v4.76,22.13 4.95,22.13
TCK  (via drill 0.2)
  Top 0.152: MAX10.G2 v6.4,23.6 | v3.7,33.98 1.71,33.98 R1.1
  Bottom 0.152: v6.4,23.6 5.39,23.6 3.85,25.15 3.85,33.83 v3.7,33.98 3.7,34.29 3.85,34.44 3.85,43.59 3.54,43.89 2.32,43.89 1.72,44.5 1.72,48.01 1.87,48.16 1.87,48.77 2.48,49.38 6.9,49.38 7.94,50.42 JTAG.4
TDI  (via drill 0.2)
  Top 0.152: R6.1 1.52,50.64 1.87,50.29 1.87,49.99 2.48,49.38 6.97,49.38 JTAG.3 | MAX10.F5 v8.8,24.4
  Bottom 0.152: v8.8,24.4 8,25.2 4.71,25.2 4.46,25.45 4.46,43.89 3.85,44.5 3.85,46.79 4.15,47.09 5.22,47.09 5.53,46.79 7.05,46.79 8.14,47.88 JTAG.3
TDO  (via drill 0.2)
  Top 0.152: MAX10.F6 v9.6,25.2
  Bottom 0.152: v9.6,25.2 8.8,25.2 8.4,25.6 5.27,25.6 4.76,26.06 4.76,44.35 4.15,44.96 4.15,46.33 4.61,46.79 4.92,46.79 5.22,46.48 8.88,46.48 9.64,47.24 9.64,49.07 9.49,49.23 9.49,49.68 9.95,50.14 10.48,50.14 JTAG.6
THRESHOLD  (via drill 0.2)
  Top 0.152: R3.2 12.87,8.97 v12.84,8.99 | v11.32,8.99 11.32,8.14 R2.1 | COMP2.7 9.48,12.8 9.49,12.8 | 9.49,12.8 COMP2.9 10.71,12.8 10.86,12.65 10.86,12.04 10.71,11.89 v10.71,11.73 | 6.38,15.6 5.98,16 COMP1.3 5.07,16 4.92,15.93 4.36,15.93 v4.1,16 | 6.38,15.6 COMP1.9 7.91,15.6 v8.02,15.24 | COMP1.7 6.53,15.46 6.38,15.6 | COMP2.5 7.44,12.41 v7.4,12.5 | COMP1.5 4.5,15.2 v4.46,15.09 | 9.49,12.8 9.29,12.8 8.88,13.21 | COMP2.3 8.88,13.21 | 8.88,13.21 9.18,13.21 v9.23,13.26
  Bottom 0.152: v12.84,8.99 v11.32,8.99 11.32,11.12 v10.71,11.73 | v8.02,15.24 8.88,14.38 8.88,13.61 v9.23,13.26 8.47,12.5 v7.4,12.5 | v4.46,15.09 4.46,15.85 v4.1,16
TMS  (via drill 0.2)
  Top 0.152: MAX10.G1 v5.6,24.4 | R7.1 1.56,47.55 1.87,47.85 1.87,48.46 2.48,49.07 4.99,49.07 JTAG.1
  Bottom 0.152: v5.6,24.4 5.05,24.4 4.15,25.3 4.15,43.74 3.7,44.2 2.48,44.2 2.02,44.65 2.02,47.85 2.17,48.01 2.17,48.62 2.48,48.92 5.14,48.92 JTAG.1